# EAGLE design KAI EFUSE 2.0.0  (EAGLE 9.6.2)

## Sheet 1 of 8
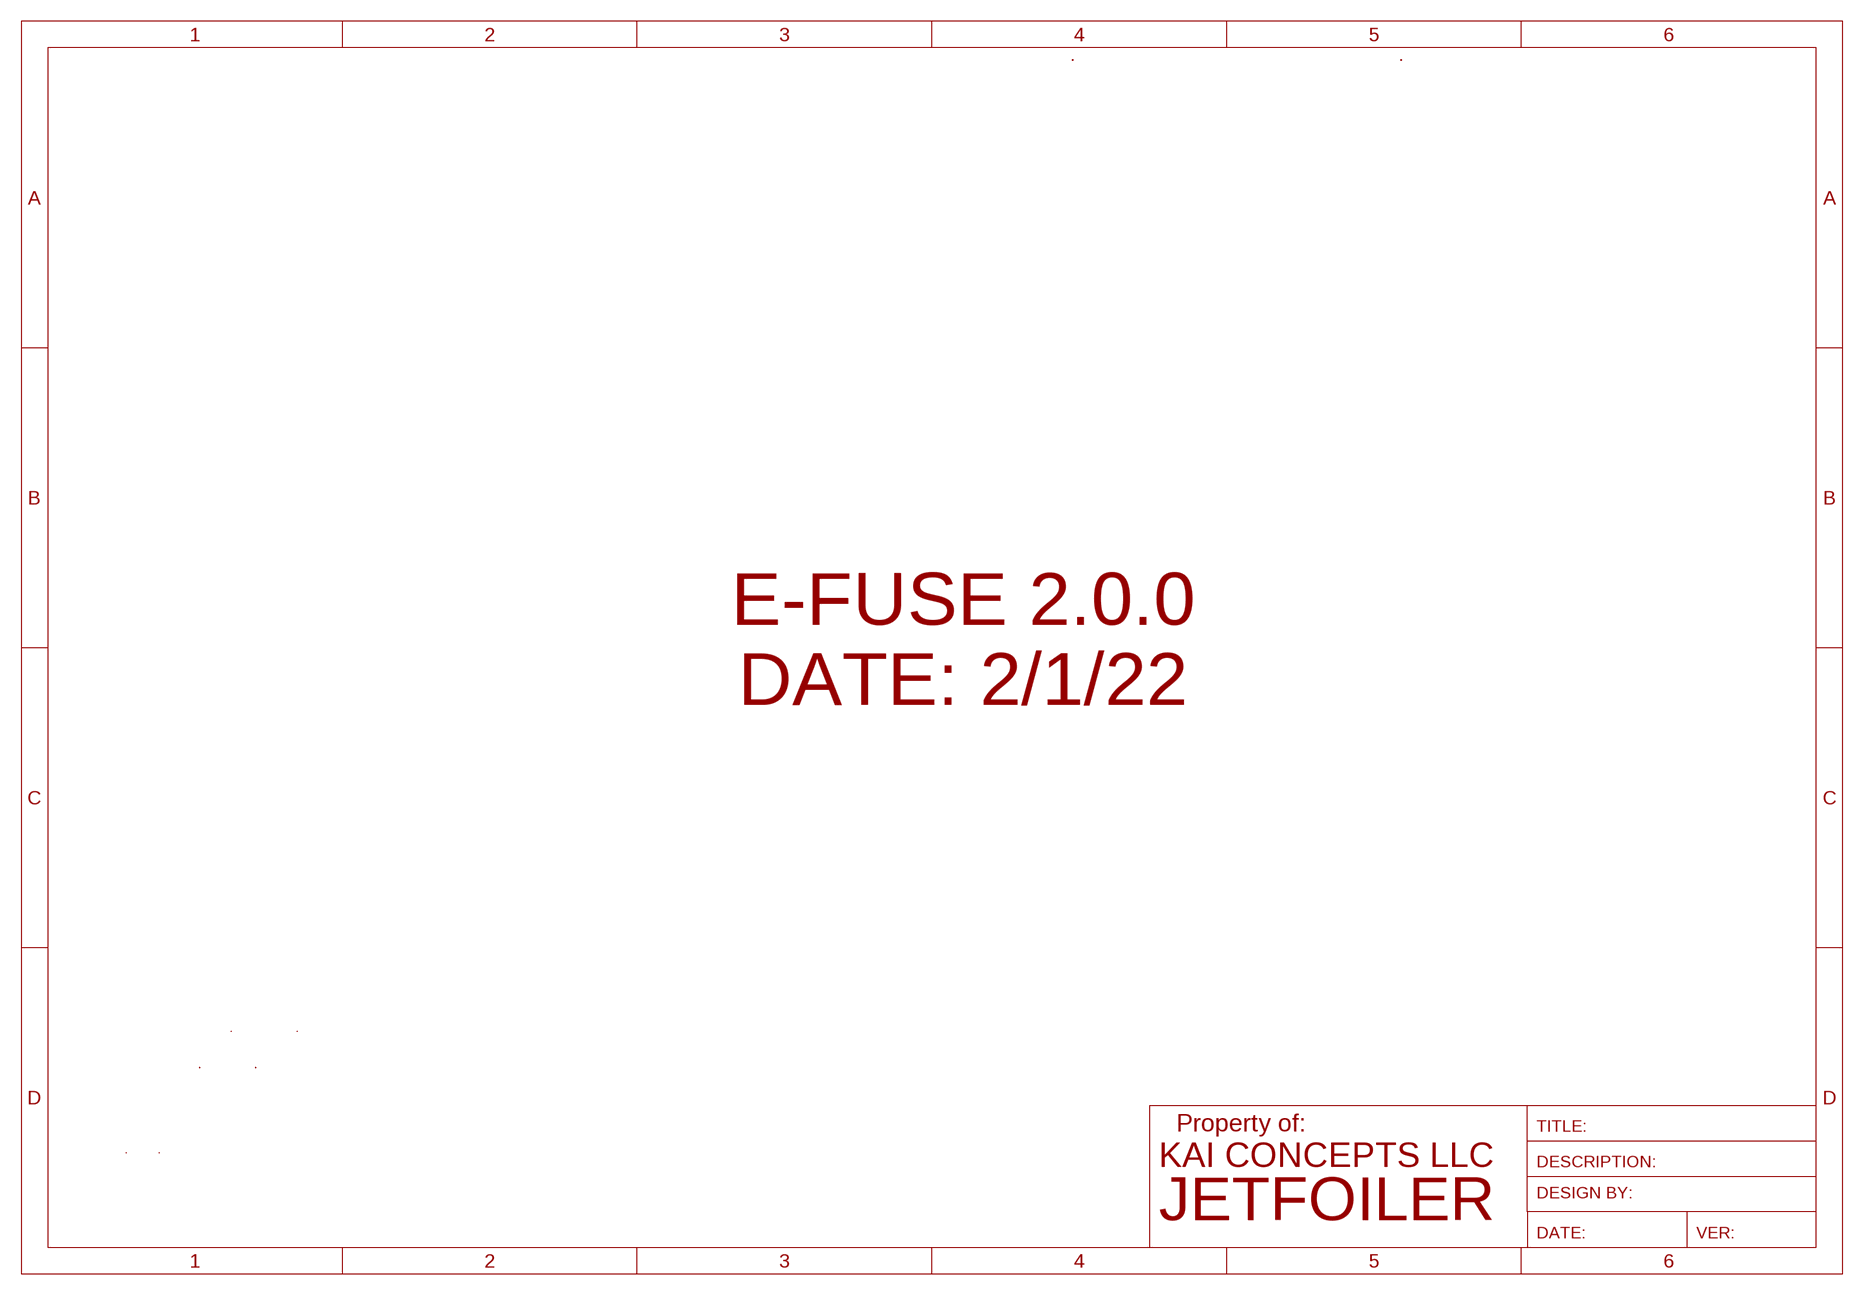
[diagram p0: schematic, sheet 1]

### Notes on the sheet
- E-FUSE 2.0.0
  DATE: 2/1/22

## Sheet 2 of 8: DC/DC
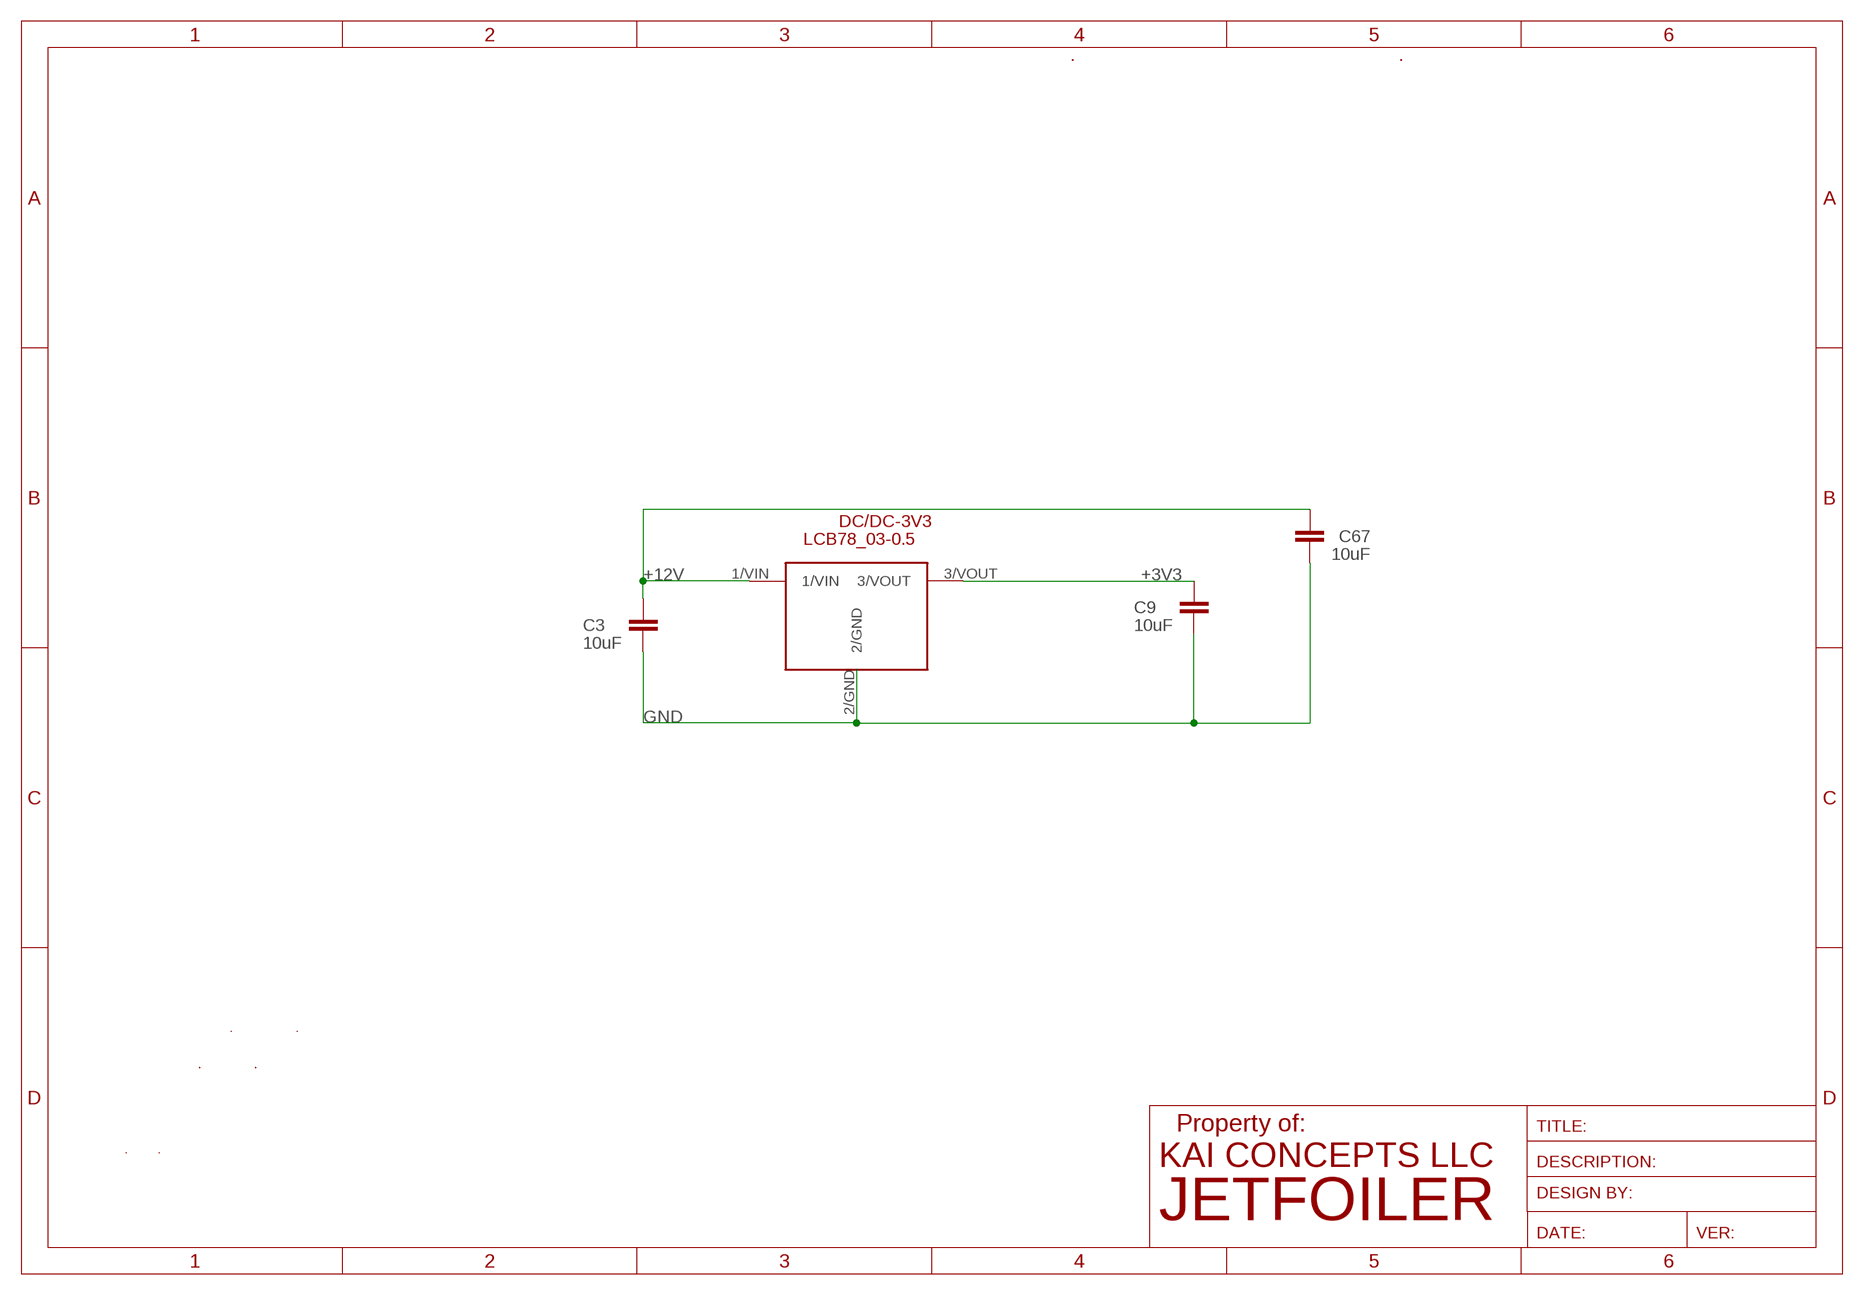
[diagram p1: schematic, sheet 2]

### Parts
C3  10uF  C-EUC1206  [C1206]
C9  10uF  C-EUC1206  [C1206]
C67  10uF  C-EUC1206  [C1206]
DC/DC-3V3  LCB78_03-0.5  3-SIP  [3-SIP]

### Nets
+3V3: C9.2 DC/DC-3V3.3/VOUT ; also sheet 3,6,7
+12V: C3.2 C67.2 DC/DC-3V3.1/VIN ; also sheet 4,5,6,7
GND: C3.1 C9.1 C67.1 DC/DC-3V3.2/GND ; also sheet 3,4,5,6,7

## Sheet 3 of 8: Over Current Protection
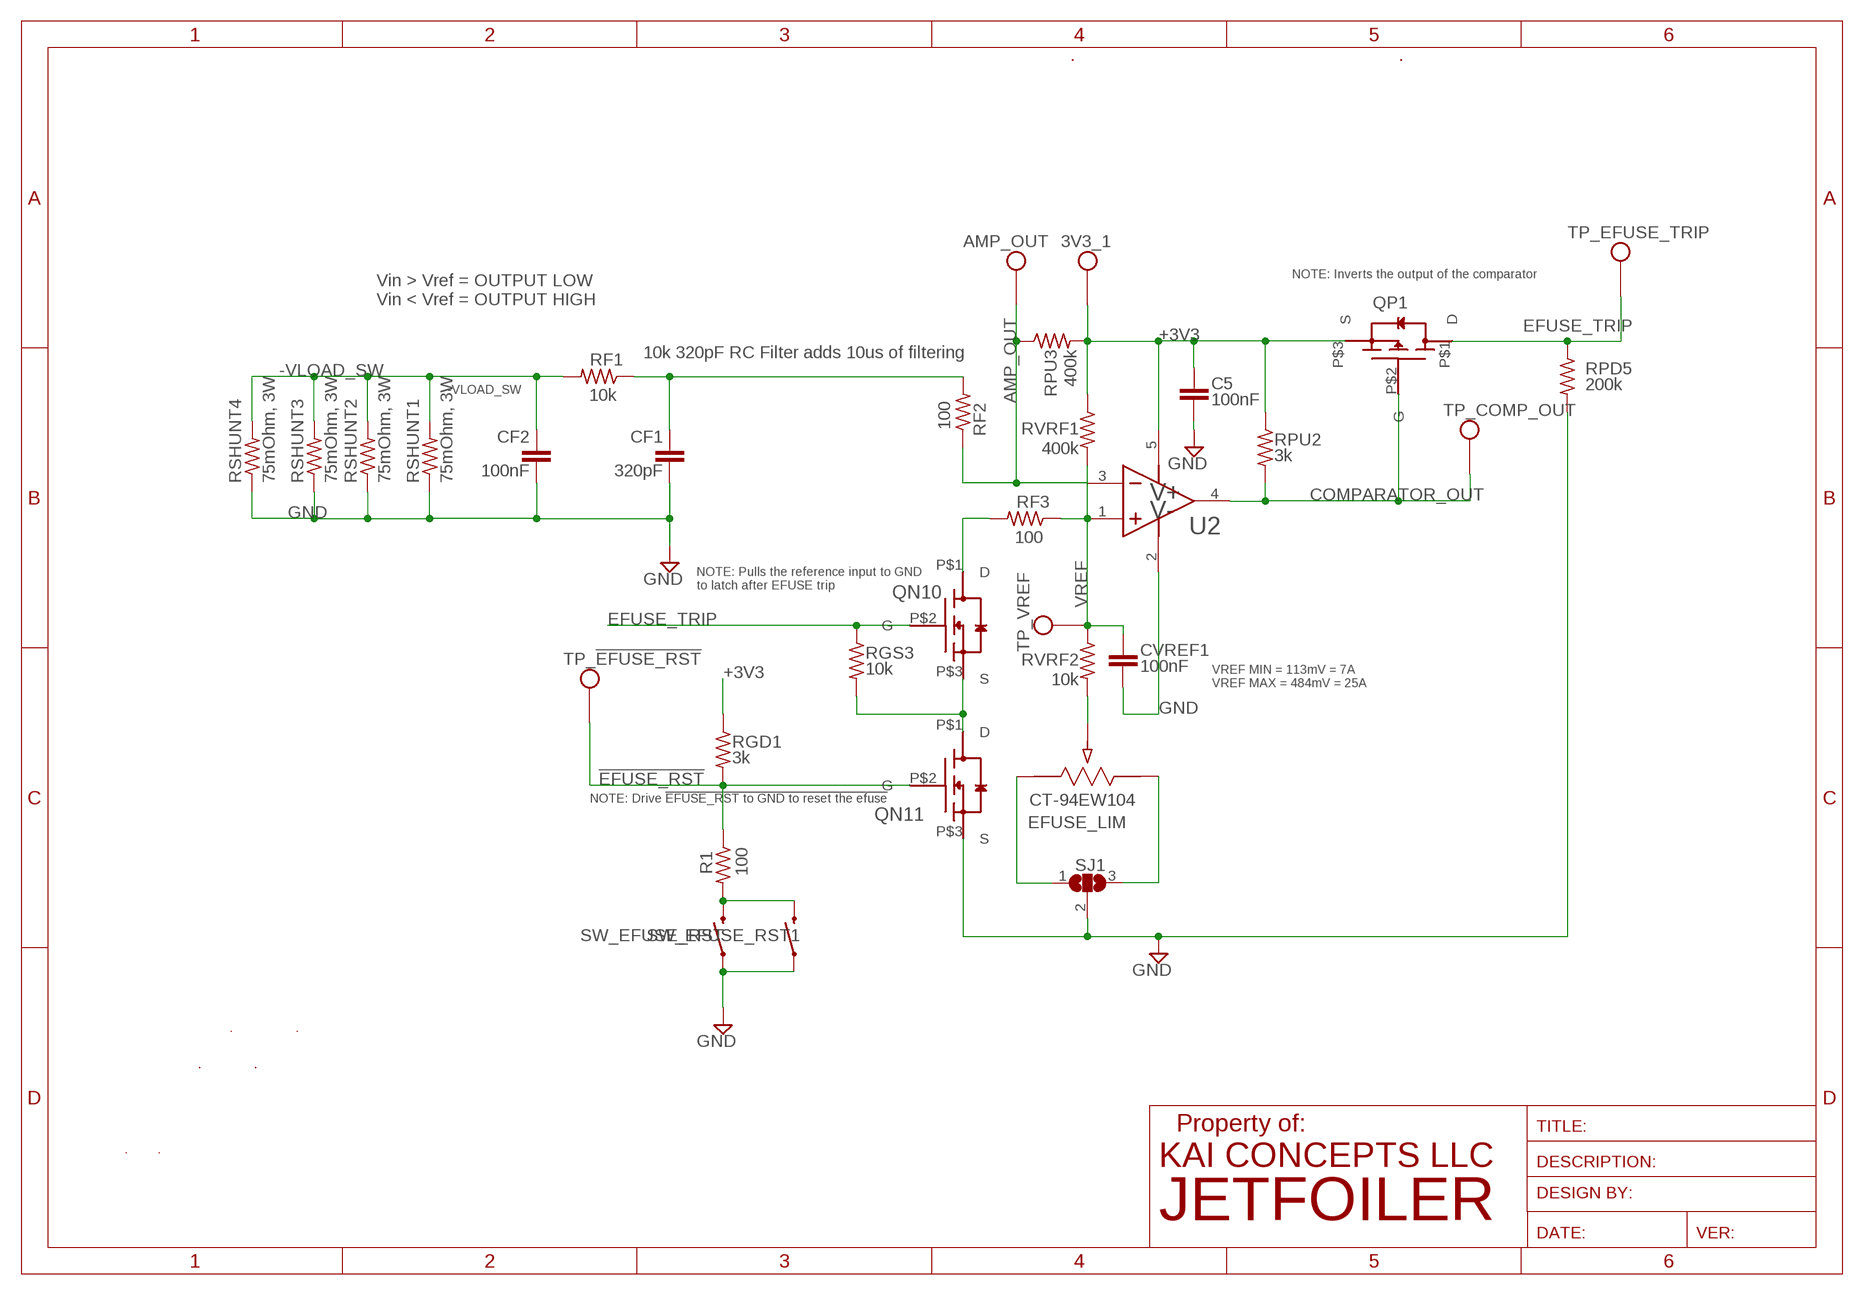
[diagram p2: schematic, sheet 3]

### Parts
3V3_1  THM_TESTPOINT_5000_SERIES  [THM-TESTPOINT]
AMP_OUT  THM_TESTPOINT_5000_SERIES  [THM-TESTPOINT]
C5  100nF  C-EUC0603  [C0603]
CF1  320pF  C-EUC0603  [C0603]
CF2  100nF  C-EUC0603  [C0603]
CVREF1  100nF  C-EUC0603  [C0603]
EFUSE_LIM  CT-94EW104  [POT_CT-94EW_NDC]
QN10  NFET-(SOT-23-3)(TO-236-3)(SC-59)  [SOT23,SC-59,TO-236-3]
QN11  NFET-(SOT-23-3)(TO-236-3)(SC-59)  [SOT23,SC-59,TO-236-3]
QP1  PFET-(SOT-23-3)(TO-236-3)(SC-59)  [SOT23,SC-59,TO-236-3]
R1  100  R-US_R0603  [R0603]
RF1  10k  R-US_R0603  [R0603]
RF2  100  R-US_R0603  [R0603]
RF3  100  R-US_R0603  [R0603]
RGD1  3k  R-US_R0603  [R0603]
RGS3  10k  R-US_R0603  [R0603]
RPD5  200k  R-US_R0603  [R0603]
RPU2  3k  R-US_R0603  [R0603]
RPU3  400k  R-US_R0603  [R0603]
RSHUNT1  75mOhm, 3W  R-US_R2512  [R2512]
RSHUNT2  75mOhm, 3W  R-US_R2512  [R2512]
RSHUNT3  75mOhm, 3W  R-US_R2512  [R2512]
RSHUNT4  75mOhm, 3W  R-US_R2512  [R2512]
RVRF1  400k  R-US_R0603  [R0603]
RVRF2  10k  R-US_R0603  [R0603]
SJ1  SJ2W  [SJ_2]
SW_EFUSE_RST  MOMENTARY-SWITCH-SPST-SMD-6.0X3.5MM  [TACTILE_SWITCH_SMD_6.0X3.5MM]
SW_EFUSE_RST1  MOMENTARY-SWITCH-SPST-SMD-6.0X3.5MM  [TACTILE_SWITCH_SMD_6.0X3.5MM]
TP_!EFUSE_RST  THM_TESTPOINT_5000_SERIES  [THM-TESTPOINT]
TP_COMP_OUT  THM_TESTPOINT_5000_SERIES  [THM-TESTPOINT]
TP_EFUSE_TRIP  THM_TESTPOINT_5000_SERIES  [THM-TESTPOINT]
TP_VREF  THM_TESTPOINT_5000_SERIES  [THM-TESTPOINT]
U2  LMV331M5X  [MF05A]

### Nets
!EFUSE_RST: QN11.P$2(G) R1.1 RGD1.2 TP_!EFUSE_RST.P1 ; also sheet 7
+3V3: 3V3_1.P1 C5.1 QP1.P$3(S) RGD1.1 RPU2.1 RPU3.2 RVRF1.1 U2.5(V+) ; also sheet 2,6,7
-VLOAD_SW: CF2.1 RF1.2 RSHUNT1.2 RSHUNT2.2 RSHUNT3.2 RSHUNT4.2 ; also sheet 4,7
AMP_OUT: AMP_OUT.P1 RF2.1 RPU3.1 U2.3(IN-)
COMPARATOR_OUT: QP1.P$2(G) RPU2.2 TP_COMP_OUT.P1 U2.4(OUT)
EFUSE_TRIP: QN10.P$2(G) QP1.P$1(D) RGS3.1 RPD5.1 TP_EFUSE_TRIP.P1 ; also sheet 4,5,6,7
GND: C5.2 CF1.2 CF2.2 CVREF1.2 QN11.P$3(S) RPD5.2 RSHUNT1.1 RSHUNT2.1 RSHUNT3.1 RSHUNT4.1 SJ1.2 SW_EFUSE_RST1.1 SW_EFUSE_RST.1 U2.2(V-) ; also sheet 2,4,5,6,7
N$9: QN10.P$1(D) RF3.2
N$13: QN10.P$3(S) QN11.P$1(D) RGS3.2
N$14: R1.2 SW_EFUSE_RST1.2 SW_EFUSE_RST.2
N$15: EFUSE_LIM.2 RVRF2.2
N$19: EFUSE_LIM.1 SJ1.1
N$20: EFUSE_LIM.3 SJ1.3
VOUTB: CF1.1 RF1.1 RF2.2
VREF: CVREF1.1 RF3.1 RVRF1.2 RVRF2.1 TP_VREF.P1 U2.1(IN+) ; also sheet 7

### Notes on the sheet
- NOTE: Inverts the output of the comparator
- Vin > Vref = OUTPUT LOW 
  Vin < Vref = OUTPUT HIGH
- 10k 320pF RC Filter adds 10us of filtering
- NOTE: Pulls the reference input to GND 
  to latch after EFUSE trip
- VREF MIN = 113mV = 7A
  VREF MAX = 484mV = 25A
- NOTE: Drive !EFUSE_RST to GND to reset the efuse

## Sheet 4 of 8: LOW SIDE SSR
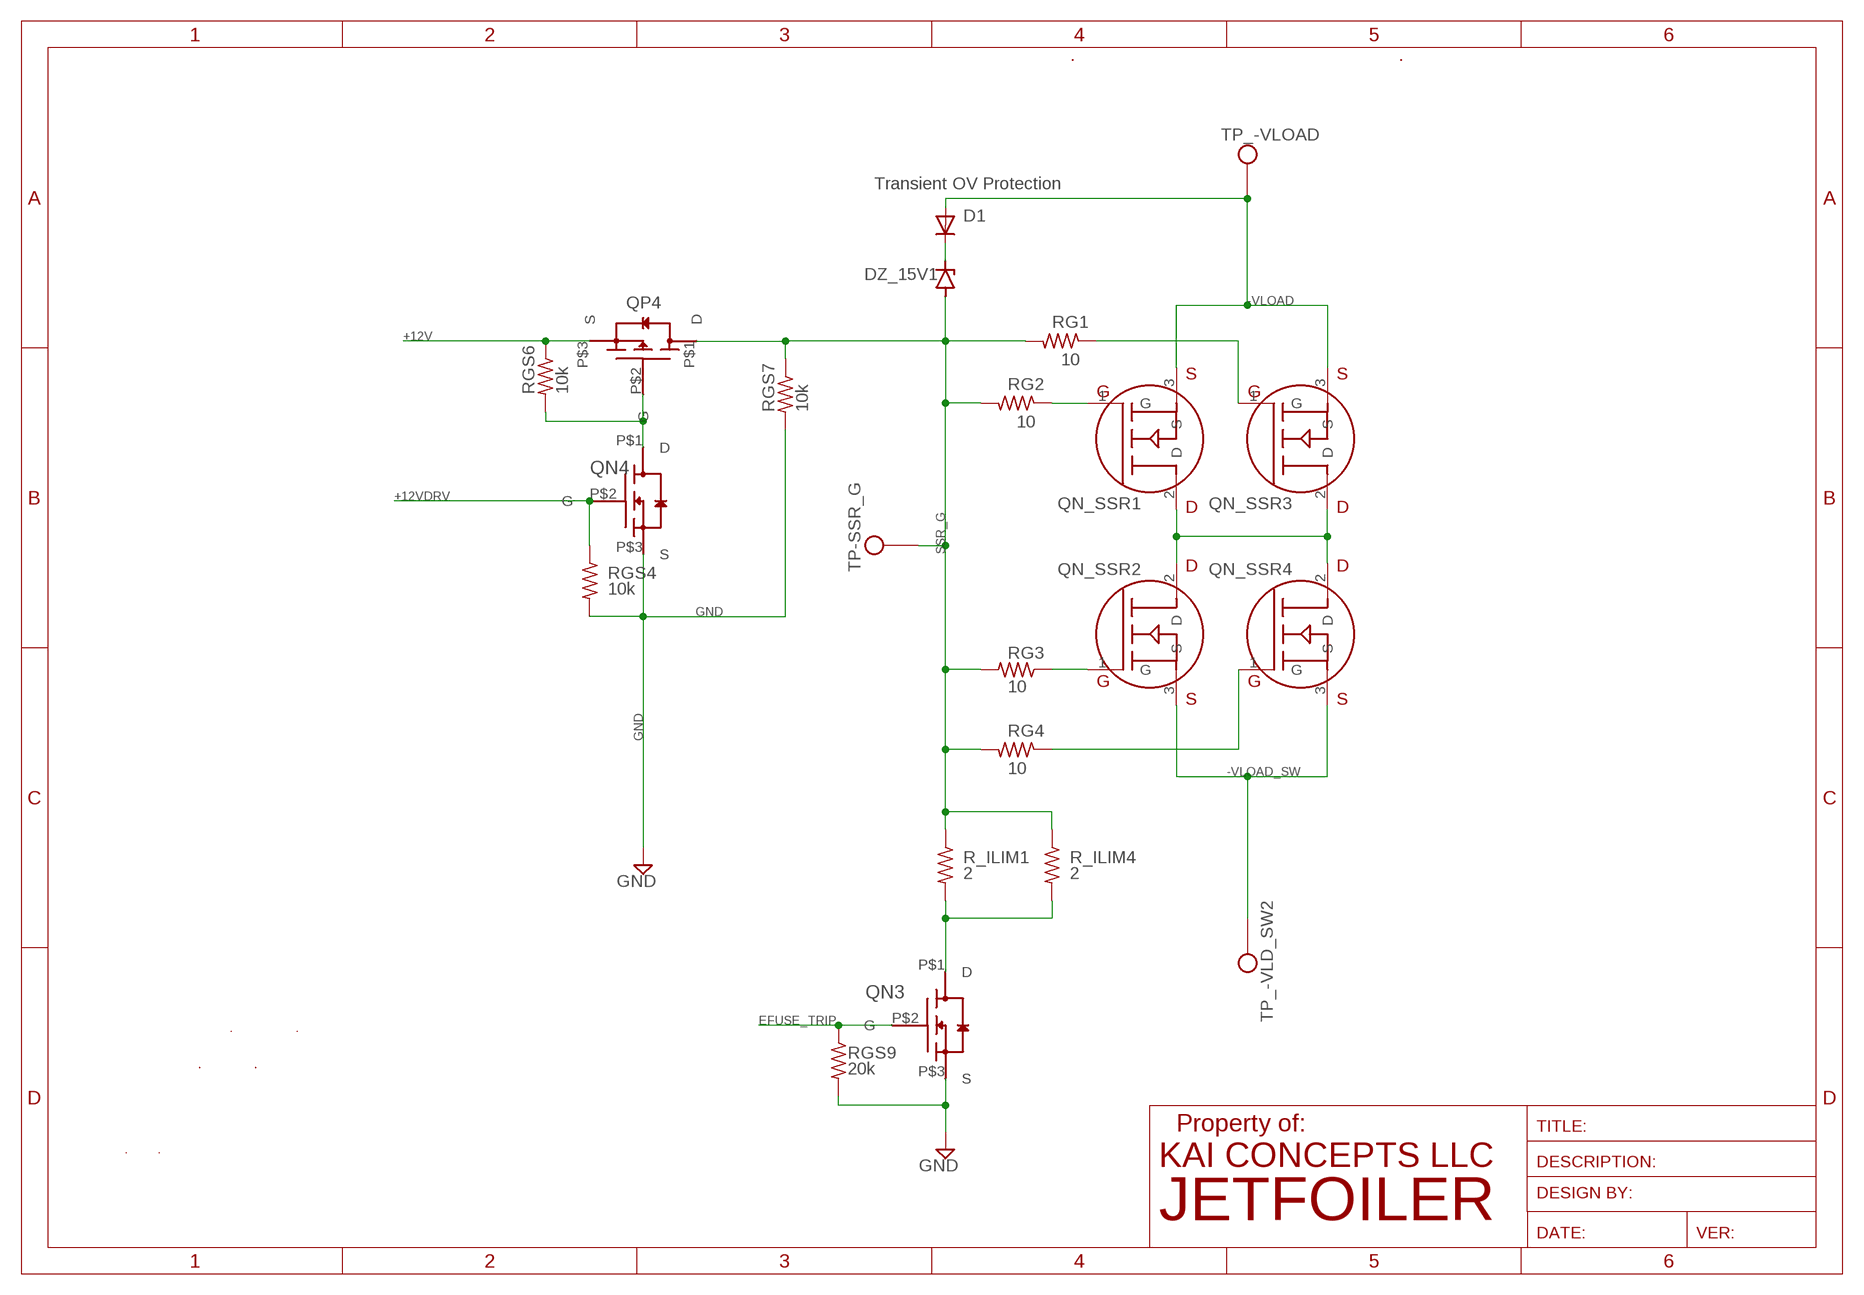
[diagram p3: schematic, sheet 4]

### Parts
D1  DIODESMA  [SMADIODE]
DZ_15V1  NZH15B,115  ZENER_MMSZ5240BTDO-219-AB(SOD123F)  [SODFL3718X115]
QN3  NFET-(SOT-23-3)(TO-236-3)(SC-59)  [SOT23,SC-59,TO-236-3]
QN4  NFET-(SOT-23-3)(TO-236-3)(SC-59)  [SOT23,SC-59,TO-236-3]
QN_SSR1  IPB60R060P7ATMA1  [D2PACK]
QN_SSR2  IPB60R060P7ATMA1  [D2PACK]
QN_SSR3  IPB60R060P7ATMA1  [D2PACK]
QN_SSR4  IPB60R060P7ATMA1  [D2PACK]
QP4  PFET-(SOT-23-3)(TO-236-3)(SC-59)  [SOT23,SC-59,TO-236-3]
R_ILIM1  2  R-US_R1206  [R1206]
R_ILIM4  2  R-US_R1206  [R1206]
RG1  10  R-US_R1206  [R1206]
RG2  10  R-US_R1206  [R1206]
RG3  10  R-US_R1206  [R1206]
RG4  10  R-US_R1206  [R1206]
RGS4  10k  R-US_R0603  [R0603]
RGS6  10k  R-US_R0603  [R0603]
RGS7  10k  R-US_R0603  [R0603]
RGS9  20k  R-US_R0603  [R0603]
TP-SSR_G  THM_TESTPOINT_5000_SERIES  [THM-TESTPOINT]
TP_-VLD_SW2  THM_TESTPOINT_5000_SERIES  [THM-TESTPOINT]
TP_-VLOAD  THM_TESTPOINT_5000_SERIES  [THM-TESTPOINT]

### Nets
+12V: QP4.P$3(S) RGS6.1 ; also sheet 2,5,6,7
+12VDRV: QN4.P$2(G) RGS4.1 ; also sheet 5,7
-VLOAD: D1.A QN_SSR1.3(S) QN_SSR3.3(S) TP_-VLOAD.P1 ; also sheet 7
-VLOAD_SW: QN_SSR2.3(S) QN_SSR4.3(S) TP_-VLD_SW2.P1 ; also sheet 3,7
EFUSE_TRIP: QN3.P$2(G) RGS9.1 ; also sheet 3,5,6,7
GND: QN3.P$3(S) QN4.P$3(S) RGS4.2 RGS7.2 RGS9.2 ; also sheet 2,3,5,6,7
N$3: QN4.P$1(D) QP4.P$2(G) RGS6.2
N$5: D1.C DZ_15V1.1(C)
N$7: QN_SSR2.1(G) RG3.1
N$8: QN_SSR3.1(G) RG1.1
N$10: QN_SSR4.1(G) RG4.1
N$12: QN_SSR1.1(G) RG2.1
N$17: QN3.P$1(D) R_ILIM1.2 R_ILIM4.2
SSR_G: DZ_15V1.2(A) QP4.P$1(D) R_ILIM1.1 R_ILIM4.1 RG1.2 RG2.2 RG3.2 RG4.2 RGS7.1 TP-SSR_G.P1
VSS_A1: QN_SSR1.2(D) QN_SSR2.2(D) QN_SSR3.2(D) QN_SSR4.2(D)

### Notes on the sheet
- Transient OV Protection

## Sheet 5 of 8: DRIVER LOAD SWITCH
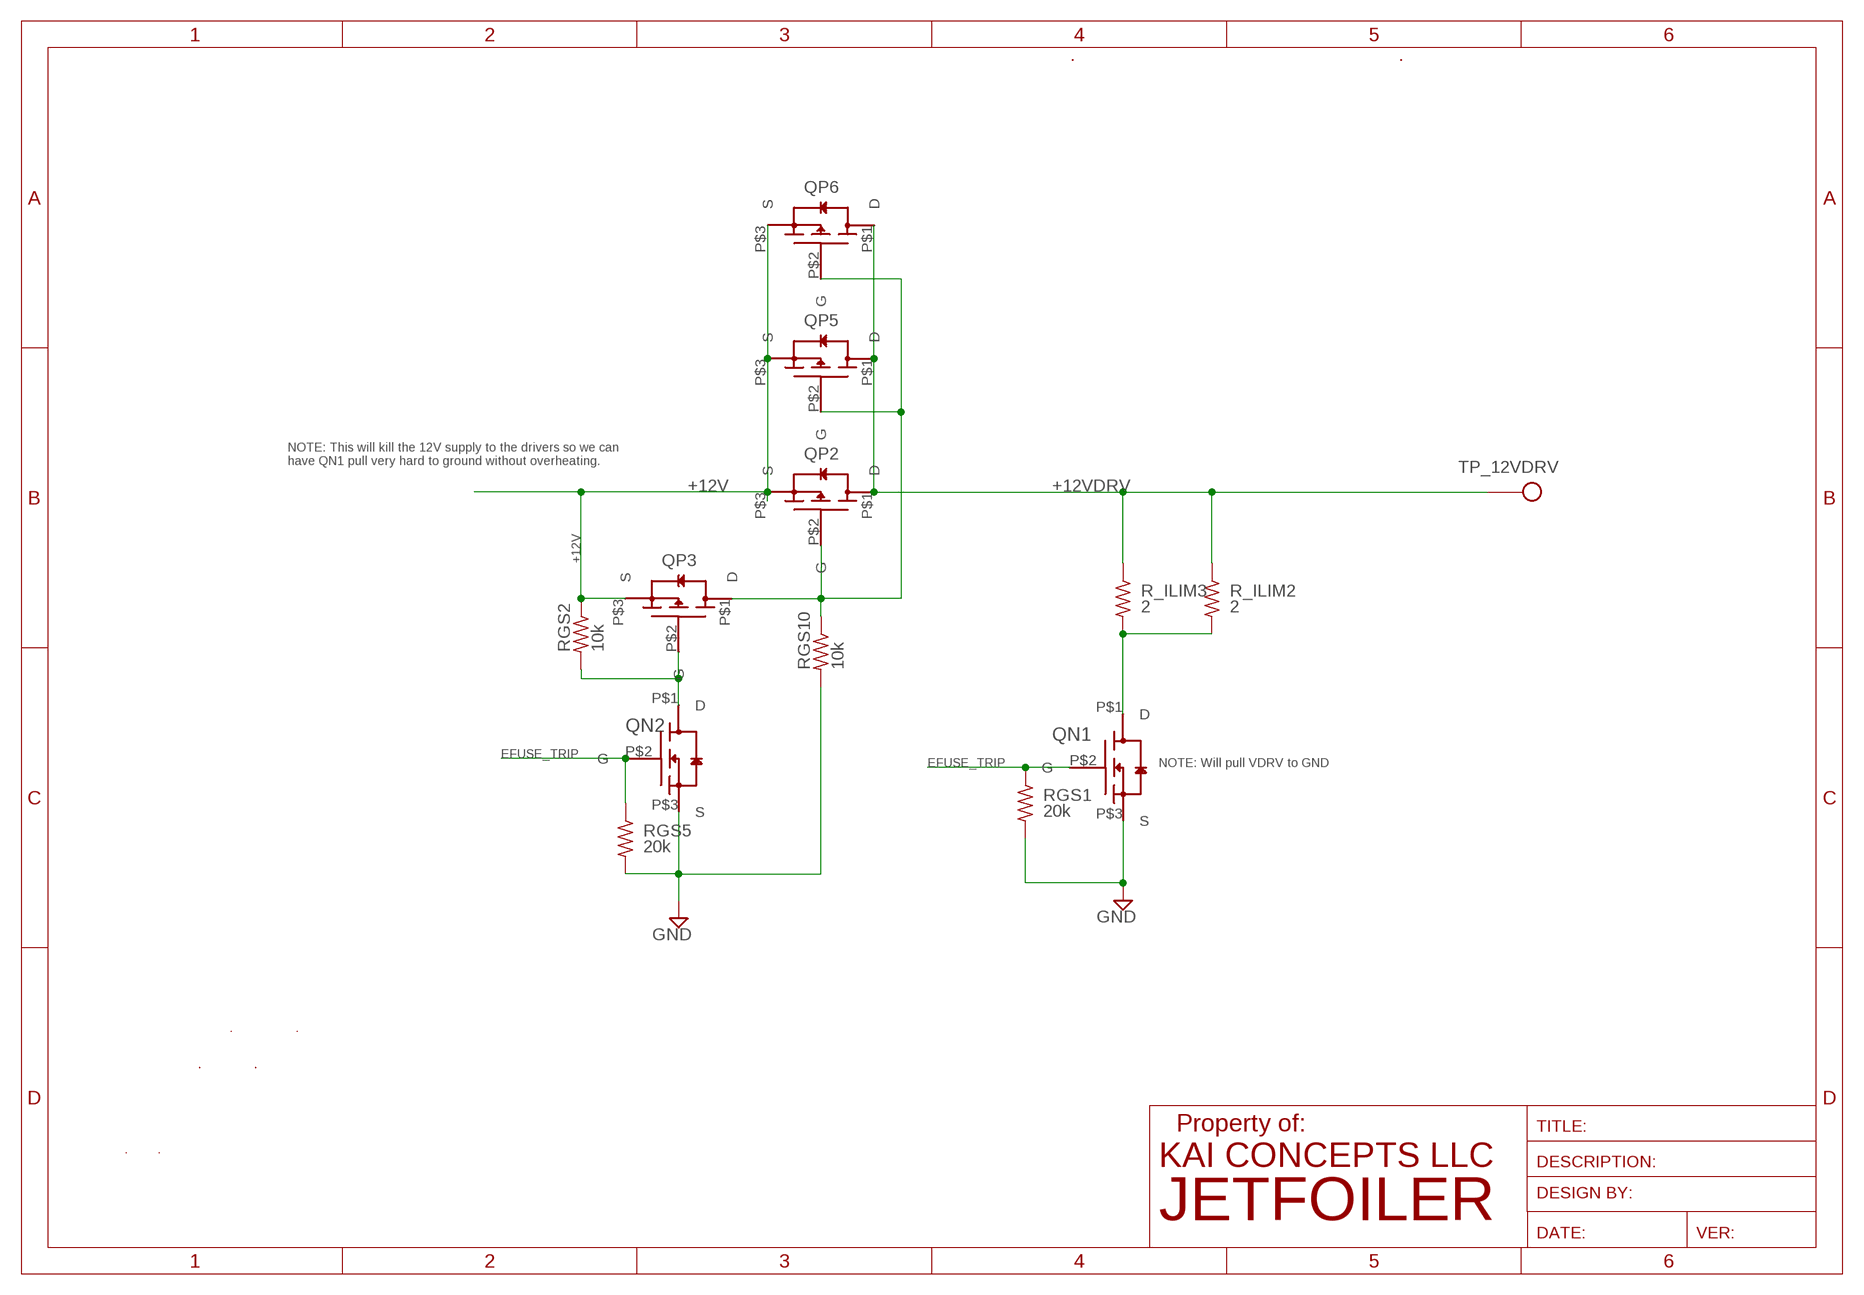
[diagram p4: schematic, sheet 5]

### Parts
QN1  NFET-(SOT-23-3)(TO-236-3)(SC-59)  [SOT23,SC-59,TO-236-3]
QN2  NFET-(SOT-23-3)(TO-236-3)(SC-59)  [SOT23,SC-59,TO-236-3]
QP2  PFET-(SOT-23-3)(TO-236-3)(SC-59)  [SOT23,SC-59,TO-236-3]
QP3  PFET-(SOT-23-3)(TO-236-3)(SC-59)  [SOT23,SC-59,TO-236-3]
QP5  PFET-(SOT-23-3)(TO-236-3)(SC-59)  [SOT23,SC-59,TO-236-3]
QP6  PFET-(SOT-23-3)(TO-236-3)(SC-59)  [SOT23,SC-59,TO-236-3]
R_ILIM2  2  R-US_R1206  [R1206]
R_ILIM3  2  R-US_R1206  [R1206]
RGS1  20k  R-US_R0603  [R0603]
RGS2  10k  R-US_R0603  [R0603]
RGS5  20k  R-US_R0603  [R0603]
RGS10  10k  R-US_R0603  [R0603]
TP_12VDRV  THM_TESTPOINT_5000_SERIES  [THM-TESTPOINT]

### Nets
+12V: QP2.P$3(S) QP3.P$3(S) QP5.P$3(S) QP6.P$3(S) RGS2.1 ; also sheet 2,4,6,7
+12VDRV: QP2.P$1(D) QP5.P$1(D) QP6.P$1(D) R_ILIM2.1 R_ILIM3.1 TP_12VDRV.P1 ; also sheet 4,7
EFUSE_TRIP: QN1.P$2(G) QN2.P$2(G) RGS1.1 RGS5.1 ; also sheet 3,4,6,7
GND: QN1.P$3(S) QN2.P$3(S) RGS1.2 RGS5.2 RGS10.2 ; also sheet 2,3,4,6,7
N$16: QP2.P$2(G) QP3.P$1(D) QP5.P$2(G) QP6.P$2(G) RGS10.1
N$18: QN2.P$1(D) QP3.P$2(G) RGS2.2
OUTA_H: QN1.P$1(D) R_ILIM2.2 R_ILIM3.2

### Notes on the sheet
- NOTE: This will kill the 12V supply to the drivers so we can 
  have QN1 pull very hard to ground without overheating.
- NOTE: Will pull VDRV to GND

## Sheet 6 of 8: LED INDICATORS & TEST POINTS
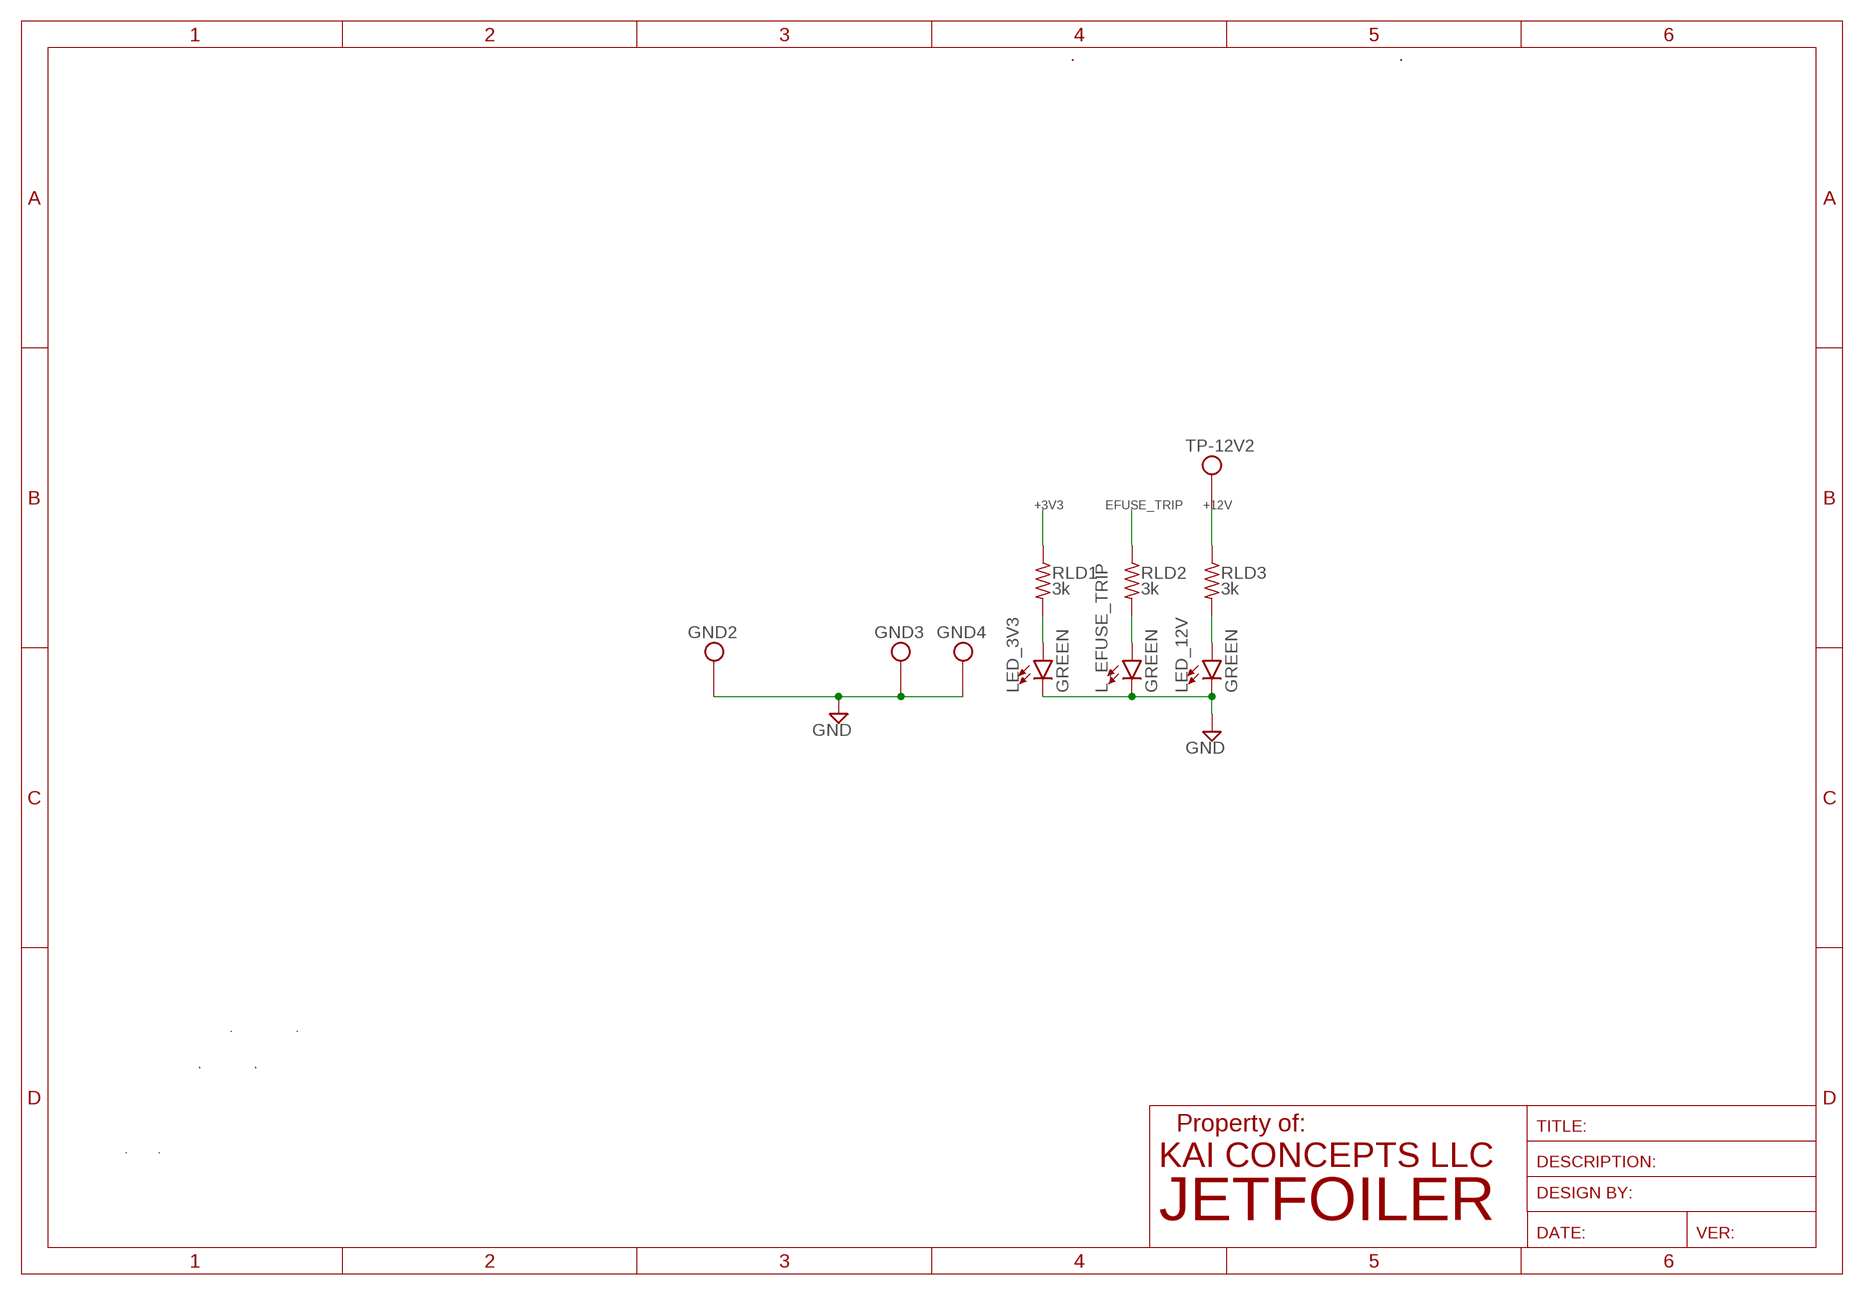
[diagram p5: schematic, sheet 6]

### Parts
GND2  THM_TESTPOINT_5000_SERIES  [THM-TESTPOINT]
GND3  THM_TESTPOINT_5000_SERIES  [THM-TESTPOINT]
GND4  THM_TESTPOINT_5000_SERIES  [THM-TESTPOINT]
L_EFUSE_TRIP  GREEN  LED-GREEN1206  [LED-1206]
LED_3V3  GREEN  LED-GREEN1206  [LED-1206]
LED_12V  GREEN  LED-GREEN1206  [LED-1206]
RLD1  3k  R-US_R0603  [R0603]
RLD2  3k  R-US_R0603  [R0603]
RLD3  3k  R-US_R0603  [R0603]
TP-12V2  THM_TESTPOINT_5000_SERIES  [THM-TESTPOINT]

### Nets
+3V3: RLD1.1 ; also sheet 2,3,7
+12V: RLD3.1 TP-12V2.P1 ; also sheet 2,4,5,7
EFUSE_TRIP: RLD2.1 ; also sheet 3,4,5,7
GND: GND2.P1 GND3.P1 GND4.P1 L_EFUSE_TRIP.C LED_3V3.C LED_12V.C ; also sheet 2,3,4,5,7
N$1: LED_3V3.A RLD1.2
N$2: L_EFUSE_TRIP.A RLD2.2
N$4: LED_12V.A RLD3.2

## Sheet 7 of 8: BOARD TO BOARD CONNECTORS
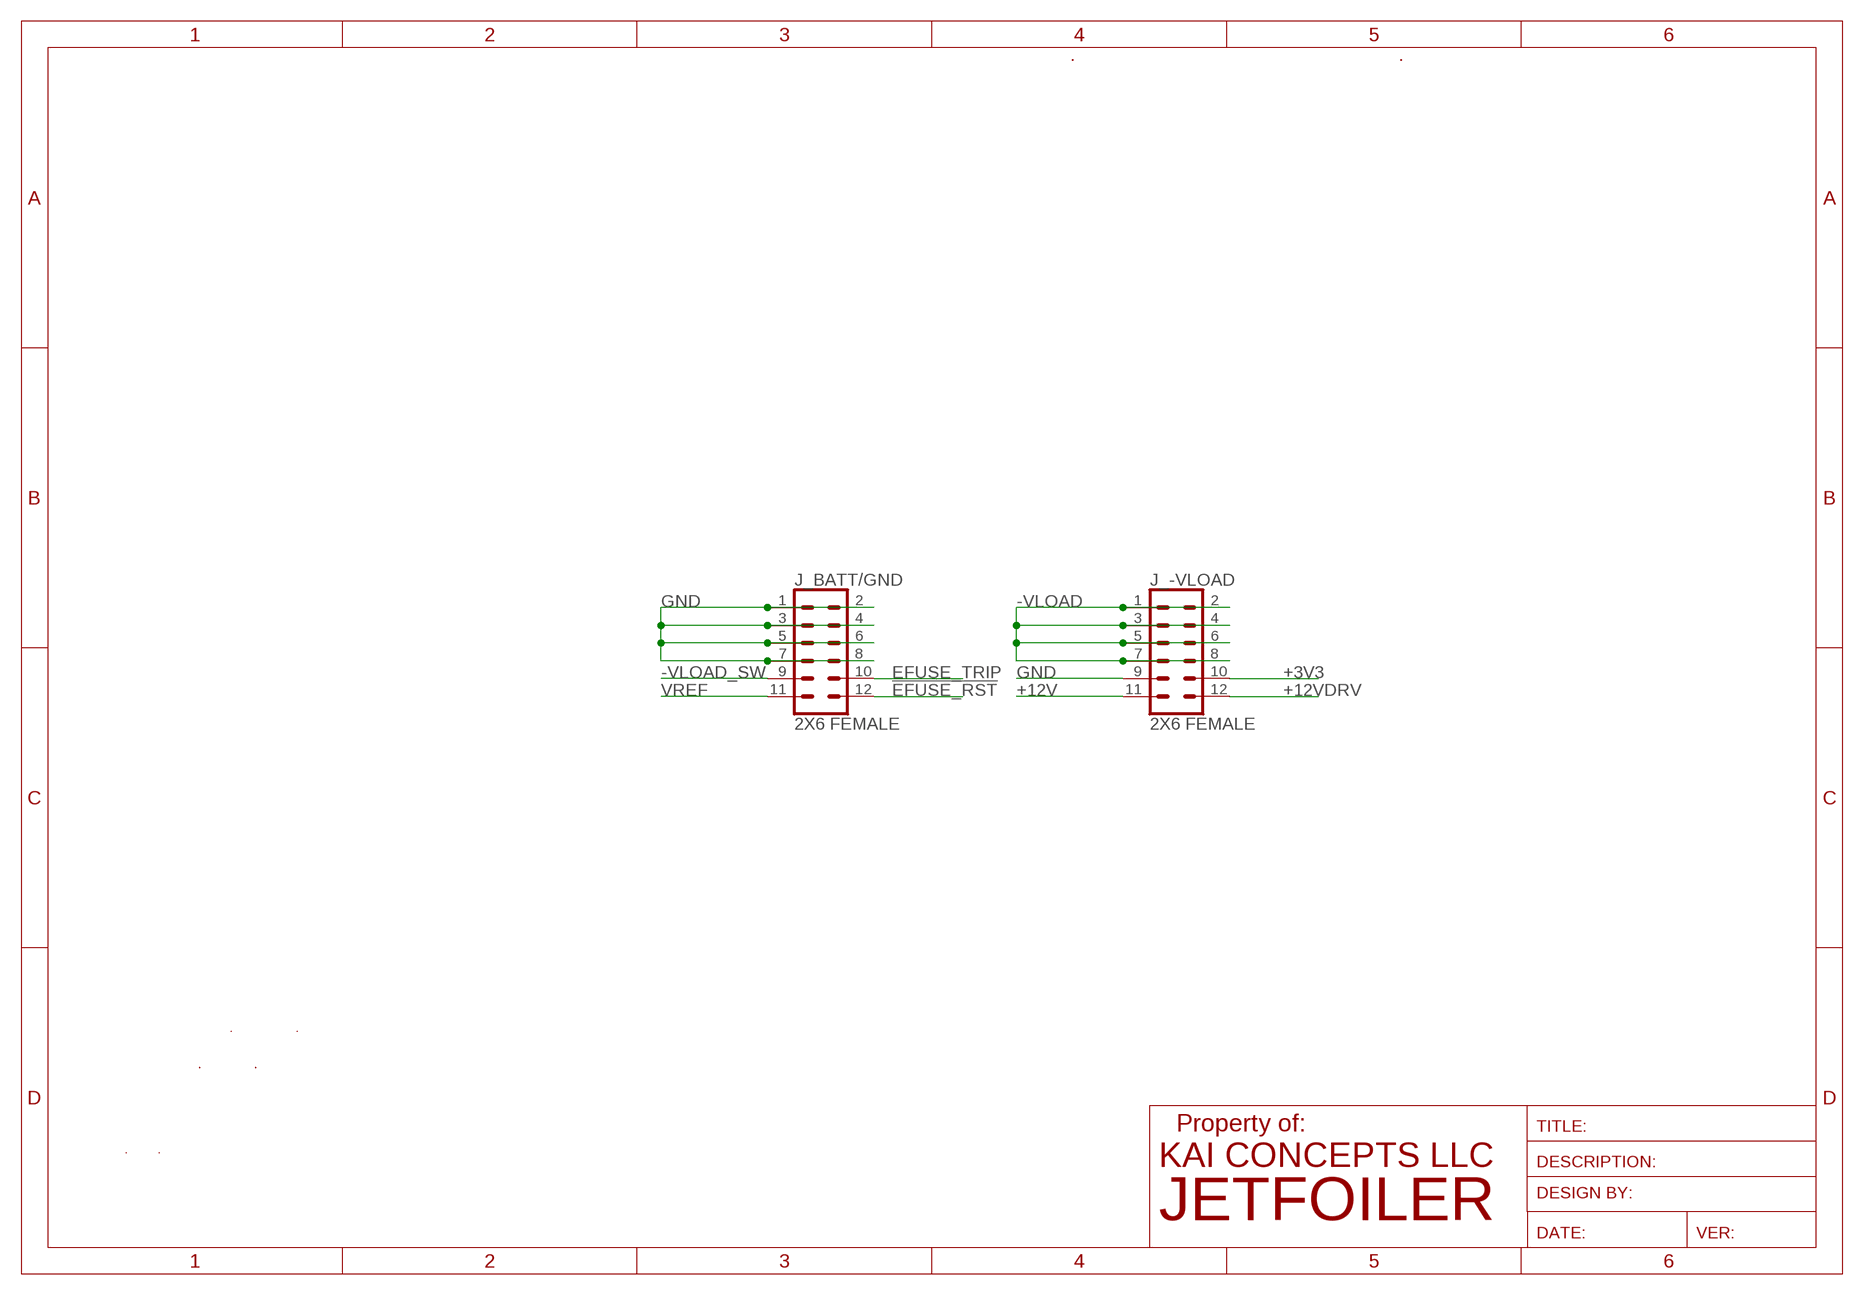
[diagram p6: schematic, sheet 7]

### Parts
J_-VLOAD  2X6 FEMALE  CONN_06X2PTH_FEMALE  [2X6]
J_BATT/GND  2X6 FEMALE  CONN_06X2PTH_FEMALE  [2X6]

### Nets
!EFUSE_RST: J_BATT/GND.12 ; also sheet 3
+3V3: J_-VLOAD.10 ; also sheet 2,3,6
+12V: J_-VLOAD.11 ; also sheet 2,4,5,6
+12VDRV: J_-VLOAD.12 ; also sheet 4,5
-VLOAD: J_-VLOAD.1 J_-VLOAD.2 J_-VLOAD.3 J_-VLOAD.4 J_-VLOAD.5 J_-VLOAD.6 J_-VLOAD.7 J_-VLOAD.8 ; also sheet 4
-VLOAD_SW: J_BATT/GND.9 ; also sheet 3,4
EFUSE_TRIP: J_BATT/GND.10 ; also sheet 3,4,5,6
GND: J_-VLOAD.9 J_BATT/GND.1 J_BATT/GND.2 J_BATT/GND.3 J_BATT/GND.4 J_BATT/GND.5 J_BATT/GND.6 J_BATT/GND.7 J_BATT/GND.8 ; also sheet 2,3,4,5,6
VREF: J_BATT/GND.11 ; also sheet 3

## Sheet 8 of 8: MECHANICAL
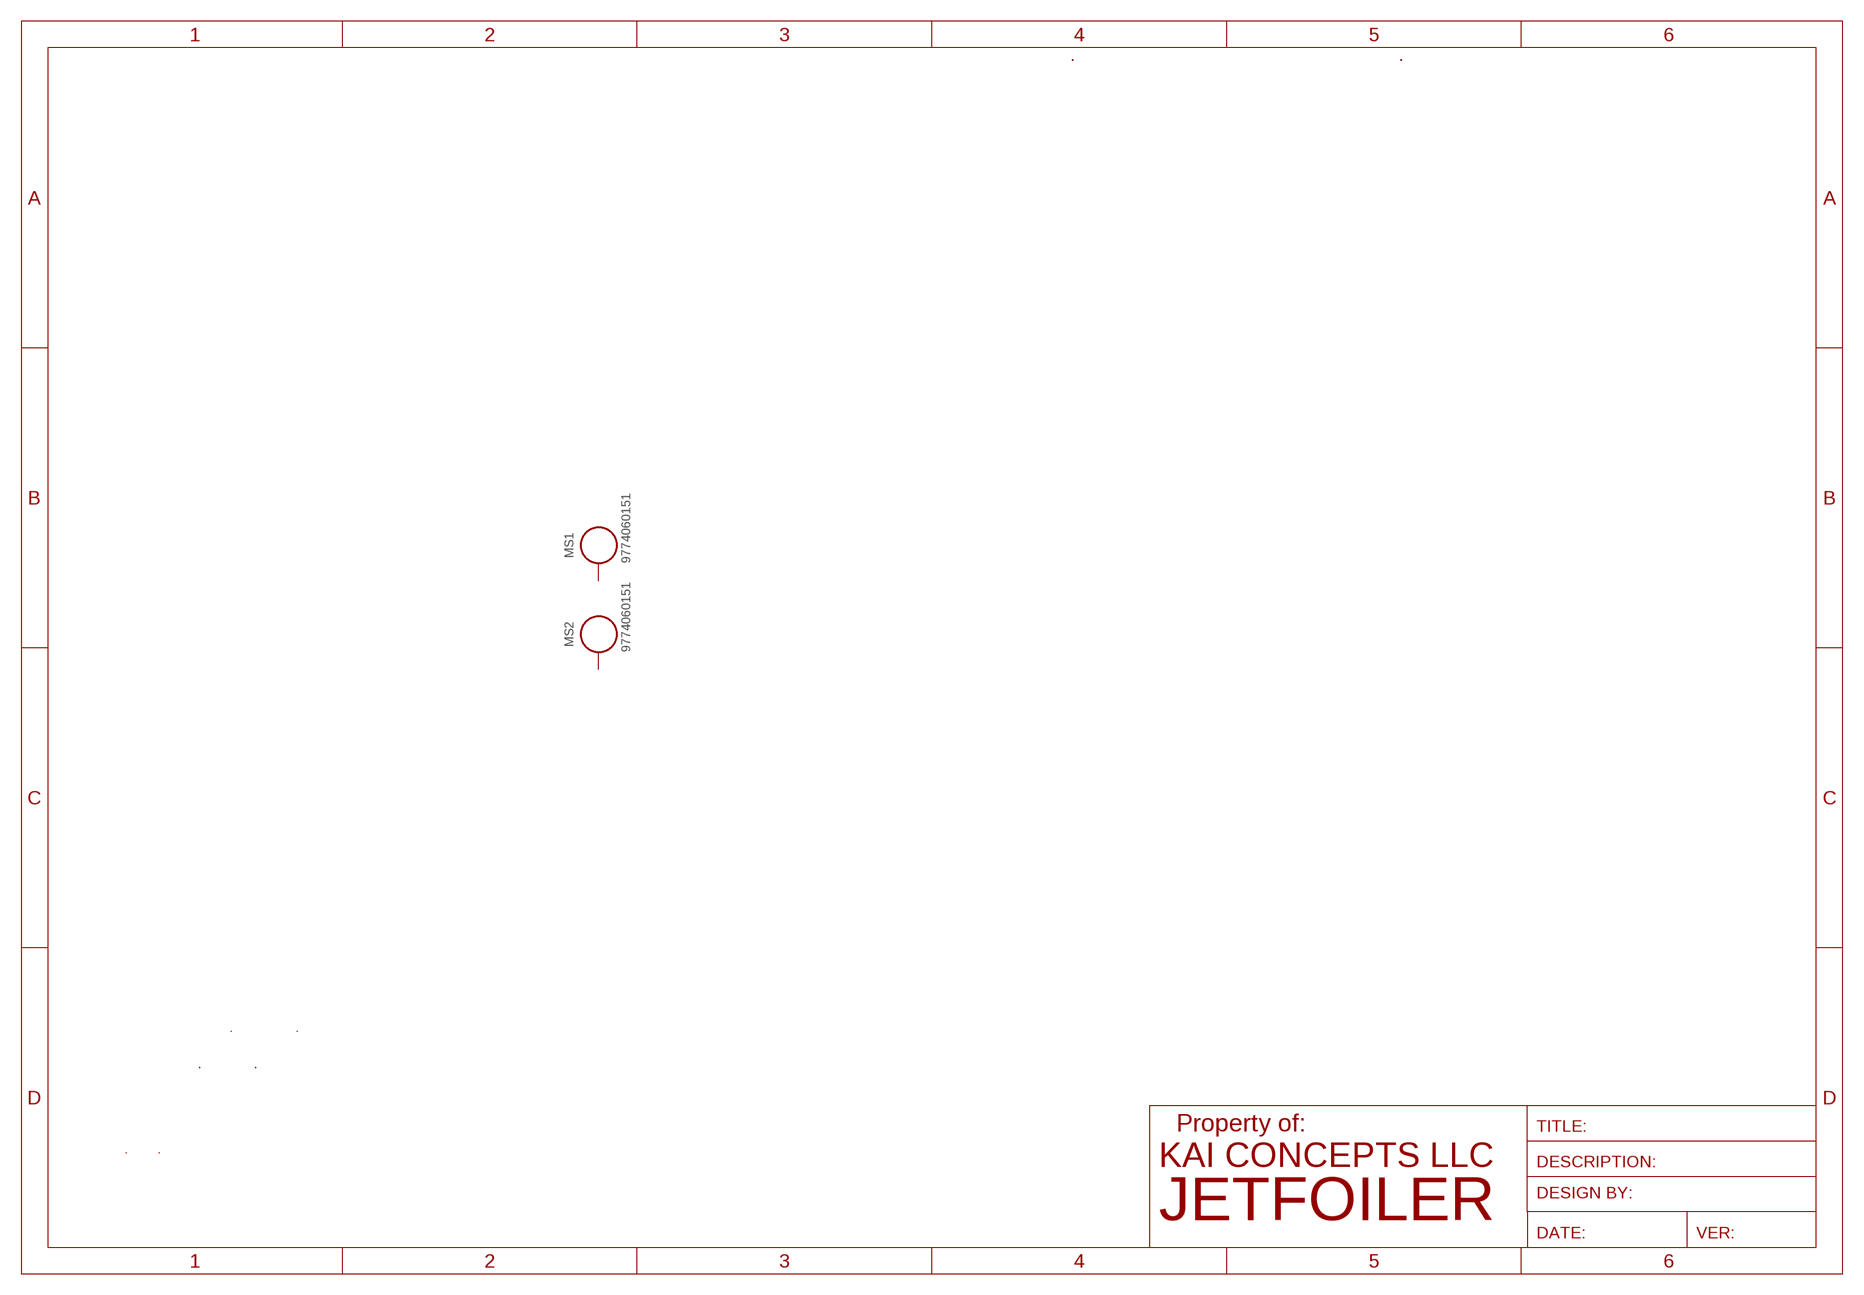
[diagram p7: schematic, sheet 8]

### Parts
MS1  9774060151  WA-SMSI_9774XXX151_9774060151  [WA-SMSI_9774060151]
MS2  9774060151  WA-SMSI_9774XXX151_9774060151  [WA-SMSI_9774060151]
Unconnected: MS1.1 MS2.1

## Library data of the parts
3V3_1 AMP_OUT GND2-GND4 TP-12V2 TP-SSR_G TP_12VDRV TP_!EFUSE_RST TP_-VLD_SW2 TP_-VLOAD TP_COMP_OUT TP_EFUSE_TRIP TP_VREF = PSFBC:THM_TESTPOINT_5000_SERIES
C3 C9 C67 = rcl:C-EU: CAPACITOR, European symbol; LCSC_PART: C13585; SPICEPREFIX: C
C5 CF1 CF2 CVREF1 = rcl:C-EU: CAPACITOR, European symbol; LCSC_PART: C14663; SPICEPREFIX: C
D1 = adafruit:DIODE: Diode SMADIODE - SMA Surface Mount Package 20V 1A Schottky Diode Digikey: 641-1014-6-ND DO-1N4148 - Through Hole Small Current Diode SOD-123 20V 1 A (.5mV Vf) Schottky Diode - Digikey: MBRX120TPMSCT-ND SOD-323 10V 570mA (.38mV Vf, 3ns) Schottky Diode - Digikey: ZLLS410CT-ND SOD-523 30V 30mA Schottky Diode (RB751S-40TE61) - Digikey: RB751S-40TE61CT-ND SOT23-R/W - SOT23 Package (R = Solder Paste/Reflow Ovens, W = Hand-Soldering) BAT54Film 40V 300mA - Digikey: 497-7162-1-ND; LCSC_PART: C110531
DC/DC-3V3 = KVRLABS-DCDC:3-SIP; LCSC_PART: DNP; MODEL: R-783.3-1.0
DZ_15V1 = Diode:ZENER_: Zener Diode - Popular parts; CATEGORY: Diode; DESCRIPTION: DIODE ZENER 10V 500MW SOD123; LCSC_PART: C173428; MANUFACTURER: ON Semiconductor; MPN: MMSZ5240BT1G; SUB-CATEGORY: Zener; THERMALLOSS: 0.5W; VALUE: MMSZ5240BT1G
EFUSE_LIM = KVRLABS-Potentiometers:CT-94EW104; COPYRIGHT: Copyright (C) 2021 Ultra Librarian. All rights reserved.; DIGI-KEY_PART_NUMBER_1: CT94EW104-ND; LCSC_PART: DNP; MANUFACTURER_PART_NUMBER: CT-94EW104; MFR_NAME: Nidec Copal Electronics
J_-VLOAD J_BATT/GND = SparkFun-Connectors:CONN_06X2: Multi connection point. Often used as Generic Header-pin footprint for 0.1 inch spaced/style header connections On any of the 0.1 inch spaced packages, you can populate with these: Break Away Headers - Straight <https://www.sparkfun.com/products/116> (PRT-00116) Break Away Male Headers - Right Angle <https://www.sparkfun.com/products/553> (PRT-00553) Female Headers <https://www.sparkfun.com/products/115> (PRT-00115) Break Away Headers - Machine Pin <https://www.sparkfun.com/products/117> (PRT-00117) Break Away Female Headers - Swiss Machine Pin <https://www.sparkfun.com/products/743> (PRT-00743); LCSC_PART: DNP; MODEL: TSW-106-05-G-D; PROD_ID: CONN-12423
L_EFUSE_TRIP LED_3V3 LED_12V = SparkFun-LED:LED-GREEN: Green SMD LED Used in manufacturing of various products at SparkFun Packages: 0603 - SMD 0603 package [Product Link] <http://www.futureelectronics.com/en/technologies/semiconductors/optoelectronics/leds/Pages/9894312-LTST-C190GKT.aspx?CrossPart=HSMG-C190&IM=0> LilyPad 1206 - SMD1206 LilyPad package [Product Link] <http://www.futureelectronics.com/en/Technologies/Product.aspx?ProductID=IN150NGHARVATEKCORPORATION2049943&IM=0> 1206 - SMD1206 package [Product Link] <http://www.futureelectronics.com/en/technologies/semiconductors/optoelectronics/leds/Pages/8315665-LTST-C150KGKT.aspx?IM=0> 1206 Bottom Mount -SMD 1206 Bottom Mount [Product Link] <http://www.digikey.com/product-detail/en/lite-on-inc/LTST-C230KGKT/160-1456-1-ND/386854> SparkFun Products: Pro Mini 328 -5V <https://www.sparkfun.com/products/821> RedBoard <https://www.sparkfun.com/products/12757> MP3 Trigger <https://www.sparkfun.com/products/13720> Makey Makey <https://www.sparkfun.com/products/11076>; LCSC_PART: C434439; PROD_ID: DIO-00862
MS1 MS2 = Eagle_WA-SMSI (rev20d) (1):WA-SMSI_9774XXX151: WA-SMSI SMT Steel Spacer, M2.5 Thread Internal PROPERTIES Material Steel Surface Tin GENERAL INFORMATION Operating Temperature -55 up to +150 °C PACKAGING PROPERTIES Packaging Bag;​ Tape and Reel;​ Bulk Packaging Unit 450 <https://katalog.we-online.de/media/images/v2/o92910v209%20Family_WA-SMSI_M2-M2.5.jpg> Details see: https://katalog.we-online.de/en/em/SMSI_SMT_STEEL_SPACER_M2_5_THREAD_INTERNAL Updated by Ella Wu 2020-05-18 2020(C) Wurth Elektronik; DATASHEET-URL: https://www.we-online.de/katalog/datasheet/9774060151.pdf; INNER-DIAMETER: 3.5mm; INNER-THREAD-LENGTH: -; LCSC_PART: DNP; OUTER-DIAMETER: 5.1mm; PART-NUMBER: 9774060151; PIN-LENGTH: 6mm; THREAD: M2.5
QN1-QN4 QN10 QN11 = KVRLABS-Nfet:Pfet:NFET-(SOT-23-3)(TO-236-3)(SC-59); LCSC_PART: C296286
QN_SSR1-QN_SSR4 = PSFBC:IPB60R060P7ATMA1: IPB60R060P7ATMA1 VDS: 650V Id: 48A(Tc) Rdson: 60mOhm Vgsth: 4V https://www.digikey.com/product-detail/en/infineon-technologies/IPB60R060P7ATMA1/IPB60R060P7ATMA1CT-ND/8259678; CISS: 4050pF; COSS: 1480pF; CRSS: 58pF; LCSC_PART: DNP; MODEL: NP109N04PUK-E1-AY; QGC: 75nC; RDSON: 30mOhm; TDELAY: 60ns; TFALL: 20ns; TRISE: 30ns; VDS: 250V; VGSMAX: +/- 20V; VGSTH: 3.5V
QP1-QP6 = KVRLABS-Nfet:Pfet:PFET-(SOT-23-3)(TO-236-3)(SC-59); LCSC_PART: C489594; MODEL: MEM2307M3G
R1 RF2 RF3 = rcl:R-US_: RESISTOR, American symbol; LCSC_PART: C103197; SPICEPREFIX: R
R_ILIM1-R_ILIM4 = rcl:R-US_: RESISTOR, American symbol; LCSC_PART: C102322; SPICEPREFIX: R
RF1 = rcl:R-US_: RESISTOR, American symbol; LCSC_PART: C491175; SPICEPREFIX: R
RG1-RG4 = rcl:R-US_: RESISTOR, American symbol; LCSC_PART: C326706; SPICEPREFIX: R
RGD1 RLD1-RLD3 RPU2 = rcl:R-US_: RESISTOR, American symbol; LCSC_PART: C126358; SPICEPREFIX: R
RGS1 RGS5 RGS9 = rcl:R-US_: RESISTOR, American symbol; LCSC_PART: C118368; SPICEPREFIX: R
RGS2-RGS4 RGS6 RGS7 RGS10 RVRF2 = rcl:R-US_: RESISTOR, American symbol; LCSC_PART: C116677; SPICEPREFIX: R
RPD5 = rcl:R-US_: RESISTOR, American symbol; LCSC_PART: C95331; SPICEPREFIX: R
RPU3 RVRF1 = rcl:R-US_: RESISTOR, American symbol; LCSC_PART: C209133; SPICEPREFIX: R
RSHUNT1-RSHUNT4 = rcl:R-US_: RESISTOR, American symbol; LCSC_PART: C459689; MODEL: RLP25FEGR075; SPICEPREFIX: R
SJ1 = jumper:SJ2W: SMD solder JUMPER; LCSC_PART: DNP
SW_EFUSE_RST SW_EFUSE_RST1 = SparkFun-Switches:MOMENTARY-SWITCH-SPST: Momentary Switch (Pushbutton) - SPST Normally-open (NO) SPST momentary switches (buttons, pushbuttons). Variants PTH-12MM - 12mm square, through-hole Momentary Pushbutton Switch - 12mm Square <https://www.sparkfun.com/products/9190> (COM-09190) PTH-6.0MM, PTH-6.0MM-KIT - 6.0mm square, through-hole Mini Pushbutton Switch <https://www.sparkfun.com/products/97> (COM-00097) KIT package intended for soldering kit's - only one side of pads' copper is exposed. PTH-RIGHT-ANGLE-KIT - Right-angle, through-hole Right Angle Tactile Button <https://www.sparkfun.com/products/10791> - Used on SparkFun BigTime Watch Kit <https://www.sparkfun.com/products/11734> SMD-12MM - 12mm square, surface-mount Tactile Button - SMD (12mm) <https://www.sparkfun.com/products/12993> (COM-12993) Used on SparkFun PicoBoard <https://www.sparkfun.com/products/11888> SMD-4.5MM - 4.5mm Square Trackball Switch Used on SparkFun Blackberry Trackballer Breakout <https://www.sparkfun.com/products/13169> SMD-4.6MMX2.8MM - 4.60mm x 2.80mm, surface mount Used on SparkFun SAMD21 Mini Breakout <https://www.sparkfun.com/products/13664> SMD-5.2MM, SMD-5.2-REDUNDANT - 5.2mm square, surface-mount Mini Pushbutton Switch - SMD <https://www.sparkfun.com/products/8720> (COM-08720) Used on Arduino Pro Mini <https://www.sparkfun.com/products/11114> REDUNDANT package connects both switch circuits together SMD-6.0X3.5MM - 6.0 x 3.5mm, surface mount Momentary Reset Switch SMD <https://www.sparkfun.com/products/8229> (COM-08229) SMD-6.2MM-TALL - 6.2mm square, surface mount Tactile Button - SMD (6mm) <https://www.sparkfun.com/products/12992> Used on SparkFun Digital Sandbox <https://www.sparkfun.com/products/12651> SMD-RIGHT-ANGLE - Right-angle, surface mount Used on SparkFun Block for Intel® Edison - Arduino <https://www.sparkfun.com/products/13036>; LCSC_PART: C520860; MODEL: TS-1092S-B3D2-G; PROD_ID: SWCH-00815; SF_SKU: COM-08229
U2 = KVRLABS-Amplifiers:LMV331M5X; COPYRIGHT: Copyright (C) 2021 Ultra Librarian. All rights reserved.; LCSC_PART: C253067; MANUFACTURER_PART_NUMBER: LMV331M5X; MFR_NAME: Texas Instruments; MODEL: LMV331M5X/NOPB

## Net classes
0 default: width 0.089 mm, drill 0.2 mm, clearance 0.089 mm

## Board
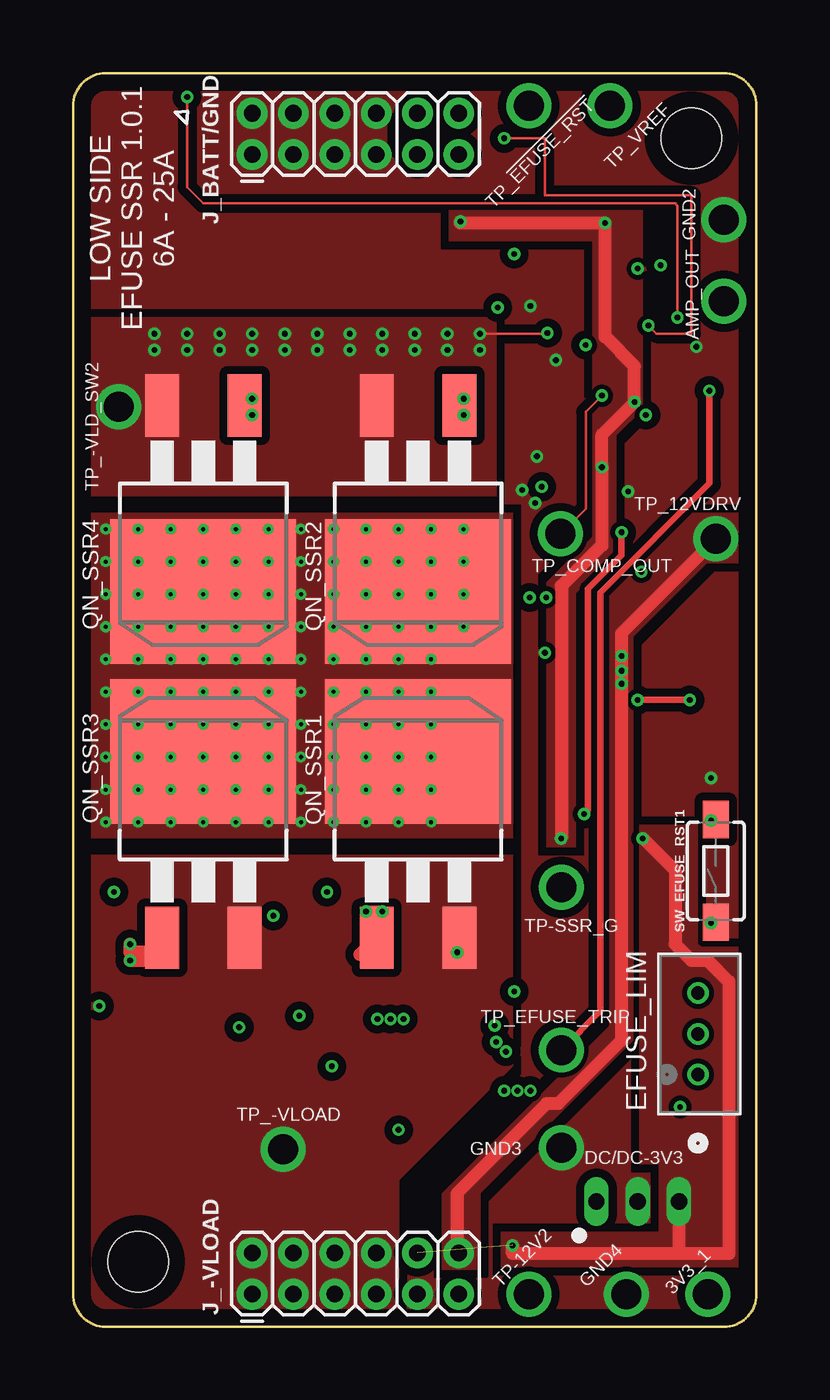
[diagram p8: board, top side]
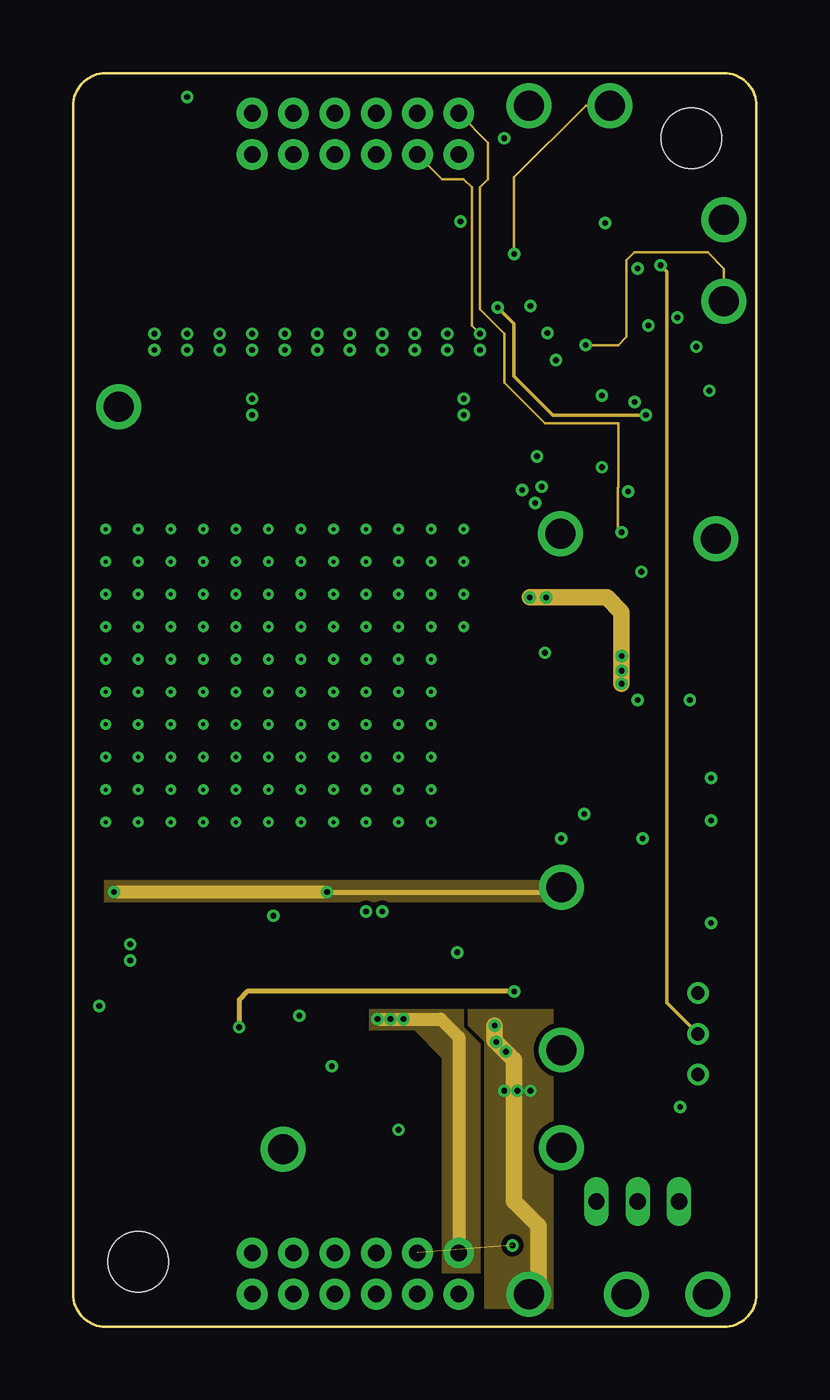
[diagram p9: board, inner layer Route2]
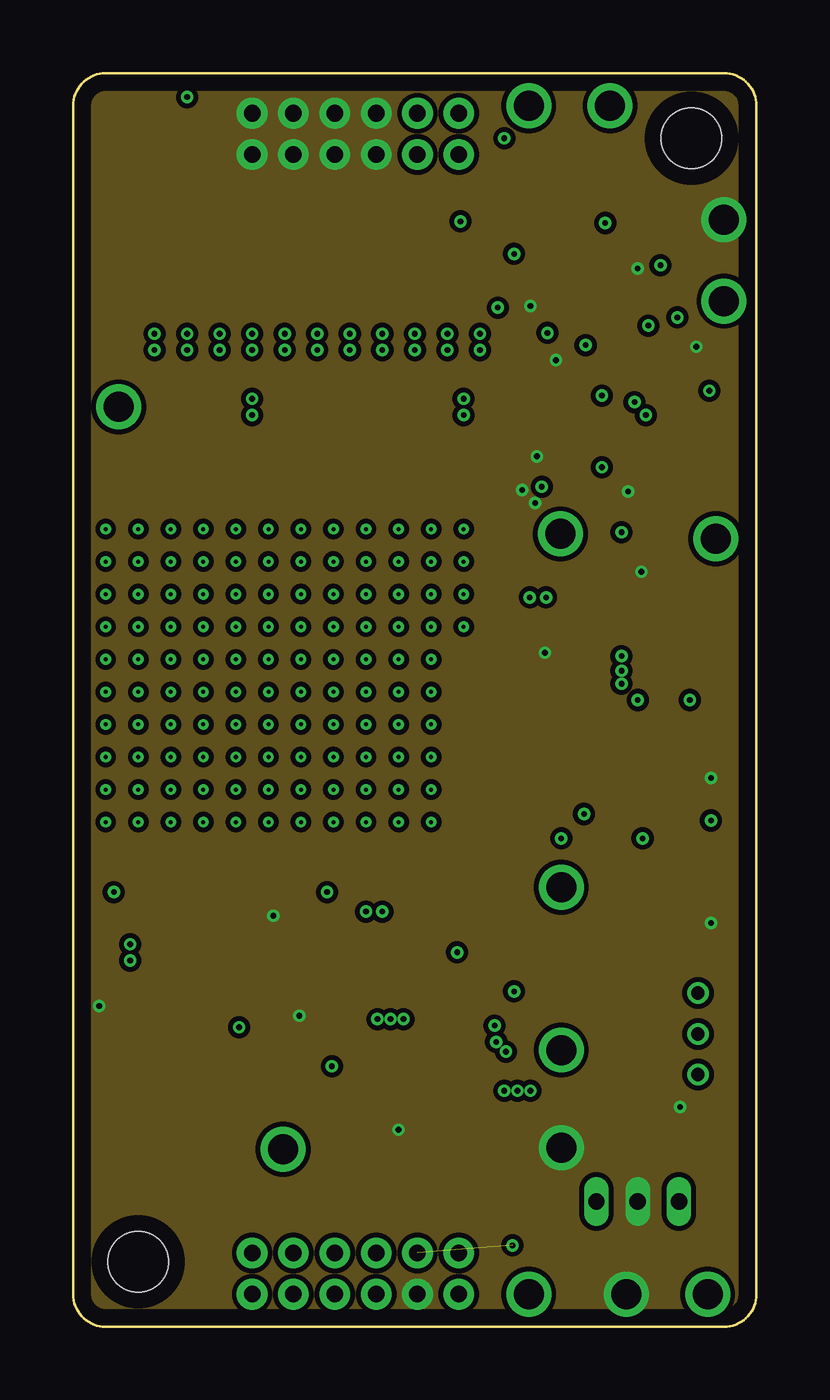
[diagram p10: board, inner layer Route15]
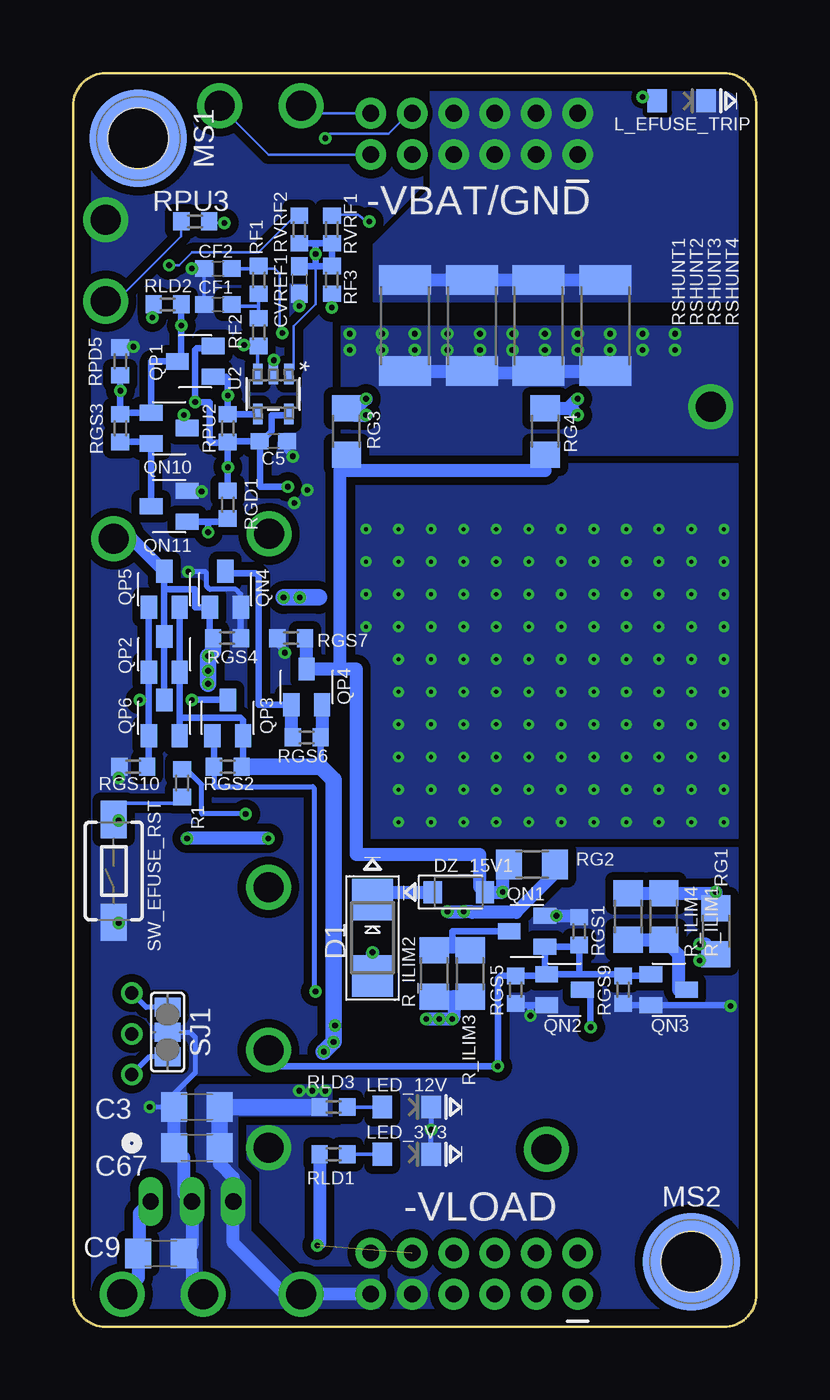
[diagram p11: board, bottom side, seen from below]

Size 42 x 77 mm. Coordinates in mm from the lower left corner, seen from the top.
Outline: 0,2 0,75 arc-90 2,77 40,77 arc-90 42,75 42,2 arc-90 40,0 2,0 arc-90 0,2
Copper layers (1*2*15*16): Top 0.035mm / dielectric 1.5mm / Route2 0.035mm / dielectric 0.15mm / Route15 0.035mm / dielectric 0.2mm / Bottom 0.035mm
Design rules "default *": minimum track width 6mil, minimum drill 0.35mm, track to track 6mil, track to pad 6mil, pad to pad 6mil, via to via 6mil, smd to smd 6mil, copper to edge 40mil, drill to drill 6mil, minimum pad ring 10mil, minimum via ring 8mil, stop-mask expansion 4mil, vias tented up to drill 0mil, thermal gap 5mil
tRestrict: area 19.8,72.3 to 20,74.1

### Footprints (pad centres in the part's own frame; a part is rotated, then mirrored left to right if it is on the bottom)
THM-TESTPOINT = drill 1.84: P1 0,0
C1206 = smd 1.6 x 1.8: 1 -1.4,0; 2 1.4,0
C0603 = smd 1.1 x 1: 1 -0.85,0; 2 0.85,0
SMADIODE = smd 2.54 x 2.54: A 2.349,0; C -2.349,0
3-SIP = drill 1 long: 1/VIN -2.54,0; 2/GND 0,0; 3/VOUT 2.54,0
SODFL3718X115 = smd 1.115 x 1.361: 1 -1.6,0; 2 1.6,0
POT_CT-94EW_NDC = drill 0.813 pad 1.321: 1 0,0; 2 2.489,0; 3 5.004,0
2X6 = drill 1.016 pad 1.88: 1 0,0; 2 0,2.54; 3 2.54,0; 4 2.54,2.54; 5 5.08,0; 6 5.08,2.54; 7 7.62,0; 8 7.62,2.54; 9 10.16,0; 10 10.16,2.54; 11 12.7,0; 12 12.7,2.54
LED-1206 = smd 1.2 x 1.4: A -1.5,0; C 1.5,0
WA-SMSI_9774060151 = smd 6 x 6: 1 0,0 | hole 3.7: 0,0
SOT23,SC-59,TO-236-3 = smd 1 x 1.4: P$1 0,1.1; P$2 -0.95,-1.1; P$3 0.95,-1.1
D2PACK = smd 2.083 x 3.81: 1 -2.54,-8.89; 3 2.54,-8.89 | smd 11.43 x 8.89: 2 0,2.54
R0603 = smd 1 x 1.1: 1 -0.85,0; 2 0.85,0
R1206 = smd 1.6 x 1.803: 1 -1.422,0; 2 1.422,0
R2512 = smd 1.8 x 3.2: 1 -2.8,0; 2 2.8,0
SJ_2 = smd 1.168 x 1.6: 1 -1.524,0; 2 0,0; 3 1.524,0
TACTILE_SWITCH_SMD_6.0X3.5MM = smd 2.3 x 1.6: 1 -3.15,0; 2 3.15,0
MF05A = smd 1.259 x 0.568: 1 -1.219,0.953; 2 -1.219,0; 3 -1.219,-0.953; 4 1.219,-0.953; 5 1.219,0.953

### Placement (x,y rotation side)
3V3_1  39,2 0 top
AMP_OUT  40,63 0 top
C3  34.4,13.5 0 bottom
C5  29.7,54.4 0 bottom
C9  36.6,4.5 180 bottom
C67  34.4,11 0 bottom
CF1  33.1,62.8 180 bottom
CF2  33.1,65 180 bottom
CVREF1  28.1,64.3 270 bottom
D1  23.6,23.9 270 bottom
DC/DC-3V3  34.7,7.7 0 top
DZ_15V1  18.3,26.7 0 bottom
EFUSE_LIM  38.4,15.5 90 top
GND2  40,68 90 top
GND3  30,11 180 top
GND4  34,2 180 top
J_-VLOAD  11,2 0 top
J_BATT/GND  11,72 0 top
L_EFUSE_TRIP  4.6,75.3 0 bottom
LED_3V3  21.5,10.6 0 bottom
LED_12V  21.5,13.5 0 bottom
MS1  38,73 0 bottom
MS2  4,4 0 bottom
QN1  14.1,24.3 90 bottom
QN2  11.8,20.7 270 bottom
QN3  5.4,20.7 270 bottom
QN4  32.65,45.3 0 bottom
QN10  36.1,55.2 270 bottom
QN11  36.1,50.4 90 bottom
QN_SSR1  21.2,32.8 0 top
QN_SSR2  21.2,47.7 180 top
QN_SSR3  8,32.8 0 top
QN_SSR4  8,47.7 180 top
QP1  34.5,59.3 90 bottom
QP2  36.4,41.3 0 bottom
QP3  32.5,37.4 0 bottom
QP4  27.65,39.3 0 bottom
QP5  36.4,45.3 0 bottom
QP6  36.4,37.4 0 bottom
R1  35.3,33.4 270 bottom
R_ILIM1  5.7,25.2 270 bottom
R_ILIM2  19.8,21.7 90 bottom
R_ILIM3  17.6,21.7 90 bottom
R_ILIM4  7.9,25.2 270 bottom
RF1  30.6,64.3 90 bottom
RF2  30.6,61.1 90 bottom
RF3  26.1,64.3 270 bottom
RG1  2.5,24.3 90 bottom
RG2  13.8,28.4 180 bottom
RG3  25.2,55 270 bottom
RG4  13,55 270 bottom
RGD1  32.5,50.5 270 bottom
RGS1  10.9,24.3 90 bottom
RGS2  32.5,34.4 180 bottom
RGS3  39.1,55.2 270 bottom
RGS4  32.55,42.3 0 bottom
RGS5  14.8,20.7 270 bottom
RGS6  27.65,36.2 180 bottom
RGS7  28.6,42.3 180 bottom
RGS9  8.2,20.7 270 bottom
RGS10  38.3,34.4 180 bottom
RLD1  26,10.6 0 bottom
RLD2  36.2,62.8 180 bottom
RLD3  26,13.5 0 bottom
RPD5  39.1,59.3 90 bottom
RPU2  32.5,55.2 90 bottom
RPU3  34.5,67.9 0 bottom
RSHUNT1  21.6,61.5 270 bottom
RSHUNT2  17.5,61.5 270 bottom
RSHUNT3  13.4,61.5 270 bottom
RSHUNT4  9.3,61.5 270 bottom
RVRF1  26.1,67.4 270 bottom
RVRF2  28.1,67.4 90 bottom
SJ1  36.2,18.1 90 bottom
SW_EFUSE_RST  39.5,28 90 bottom
SW_EFUSE_RST1  39.5,28 90 top
TP-12V2  28,2 180 top
TP-SSR_G  30,27 0 top
TP_12VDRV  39.5,48.4 0 top
TP_!EFUSE_RST  28,75 0 top
TP_-VLD_SW2  2.8,56.5 90 top
TP_-VLOAD  12.9,10.9 180 top
TP_COMP_OUT  29.95,48.7 0 top
TP_EFUSE_TRIP  30,17 0 top
TP_VREF  33,75 0 top
U2  29.7,57.3 270 bottom

### Tracks (layer width: path | path; a pad name or v marks a point on that pad's centre or on a via)
!EFUSE_RST  (via drill 0.35)
  Top 0.406: v33.7,48.8 33.7,47.39 31.64,45.33 31.64,31.74 v31.4,31.5
  Route2 0.152: v33.7,48.8 33.49,49.01 33.49,51.55 33.5,51.56 33.5,55.5 29,55.5 26.5,58 26.5,61 25,62.5 25,70 25.5,70.5 25.5,72.74 J_BATT/GND.12
  Bottom 0.152: J_BATT/GND.12 27.54,74.54 TP_!EFUSE_RST.P1
  Bottom 0.305: v31.4,31.5 34.1,31.5 34.1,33.3 35.05,34.25 R1.1
  Bottom 0.406: QN11.P$2 33.6,49.45 | 33.6,49.45 32.7,49.45 RGD1.2 | 33.6,49.45 33.7,49.35 v33.7,48.8
+3V3  (via drill 0.35)  (1 unrouted)
  Top 0.813: v30,30 30,45.5 32.5,48 v32.5,52.8 32.5,54.8 v34.5,56.8 34.5,59 32.7,60.8 v32.7,67.8 23.8,67.8 v23.8,67.9 | v35,30 37,28 37,23.5 38,22.5 39,22.5 40.3,21.2 40.3,4.5 37,4.5 | 37,4.5 27,4.5 v27,5 | DC/DC-3V3.3/VOUT 37.24,4.74 37,4.5
  Bottom 0.152: RPU3.2 33.55,67.8 v32.7,67.8 | RVRF1.1 26.05,68.3 24.5,68.3 23.97,67.9 v23.8,67.9
  Bottom 0.406: QP1.P$3 33.55,60.1 34.4,60.1 34.5,60 v34.5,56.8 33.6,56.8 33.6,54.3 32.55,54.3 RPU2.1 | C5.1 32.45,54.4 RPU2.1 | RPU2.1 v32.5,52.8 RGD1.1 | U2.5 28.83,56 29.8,56 29.8,55 30.4,54.4 C5.1 | C5.1 30.5,54.35 30.5,51.6 v28.8,51.6
  Bottom 0.813: DC/DC-3V3.3/VOUT 37.94,7 37.94,4.56 C9.2 38,3 3V3_1.P1 | RLD1.1 26.85,5.15 v27,5 | v30,30 v35,30
  pour Top (isolate 0.3, no thermals): 26.3,3.7 42.7,3.7 42.9,3.9 42.9,23.3 38.6,23.3 38.4,23.5 38.4,30.8 34.8,30.8 34.8,10 36,10 36,5.8 26.3,5.8
  pour Top (isolate 0.3, no thermals): 30.9,29.6 30.9,45.1 33.4,47.6 33.4,54.8 35,56.4 35,68.6 23.1,68.6 23.1,66.7 31.9,66.7 31.9,48.5 29.1,45.7 29.1,29.5 30.9,29.5
+12V  (via drill 0.35)
  Route2 1.016: TP-12V2.P1 28.6,2.6 28.6,6.2 27.1,7.7 27.1,16.4 v26,17.5 25.9,17.6 v25.9,18.5
  Bottom 0.406: QP5.P$3 QP2.P$3 35.45,37.4 | 35.45,37.4 QP6.P$3 | RGS2.1 31.55,34.5 QP3.P$3 31.55,37.25 31.7,37.4 35.45,37.4 | 26.8,34.4 RGS6.1
  Bottom 0.813: QP4.P$3 26.7,36.3 RGS6.1 | J_-VLOAD.11 TP-12V2.P1 29,2 32.16,5.16 DC/DC-3V3.1/VIN 32.16,9.16 33,10 C67.2
  Bottom 1.016: RGS2.1 26.8,34.4 26,33.6 v26,17.5 v26.6,16.9 | RLD3.1 C3.2 C67.2
  other vias: 26.5,14.5 27.3,14.5 28.1,14.5
  pour Route2 (isolate 0.3, no thermals): 25.3,-1.3 25.3,17.5 24.3,18.5 24.3,19.5 29.5,19.5 29.5,-1.5 25.5,-1.5
  pour Bottom (isolate 0.3, no thermals): 26.1,14.8 26.1,12.9 31.9,12.9 31.9,9.8 31.1,9 31.1,5.9 28.5,3.3 28.4,3.2 23.2,3.2 23.2,-1.1 23.3,-1.2 31.3,-1.2 31.5,-1 33.5,1 33.5,8.4 34.5,9.4 34.5,14.6 34.2,14.9 26.1,14.9
+12VDRV  (via drill 0.35)
  Top 0.813: TP_12VDRV.P1 33.7,42.6 v33.7,41.2 33.7,17.6 29.8,13.7 29.1,13.7 23.6,8.2 23.6,4.64 J_-VLOAD.12
  Route2 0.813: v18.7,18.9 22.6,18.9 23.7,17.8 J_-VLOAD.12
  Route2 1.016: v33.7,39.5 33.7,43.9 32.8,44.8 v29.06,44.8 v28.06,44.8
  Bottom 0.406: QP2.P$1 36.4,45.3 | 36.4,45.3 QP5.P$1 | QP2.P$1 QP6.P$1 | QP2.P$1 36.3,42.3 | RGS4.1 33.6,42.3 QN4.P$2 34.5,44.2 34.5,45.3 36.4,45.3
  Bottom 0.813: R_ILIM2.1 18.6,20.28 | 18.6,20.28 R_ILIM3.1 | 18.6,20.28 18.6,19 v18.7,18.9 v20.3,18.9 | QP5.P$1 38.4,48.4 TP_12VDRV.P1
  Bottom 1.016: RGS4.1 33.4,41.5 v33.7,41.2 v33.7,39.5 | 26.9,44.8 v29.06,44.8
  other vias: 19.5,18.9 33.7,40.3
  pour Top (isolate 0.3, no thermals): 22.7,3.5 22.7,8.2 33,18.5 33,44.9 38.1,50 44.6,50 44.6,46.9 38.9,46.9 34.4,42.4 34.4,17.6 25,8.2 25,3.6 24.9,3.5
  pour Route2 (isolate 0.3, no thermals): 18.2,19.5 24,19.5 24,18.4 25,17.4 25,3.3 22.7,3.3 22.7,16.5 21,18.2 18.2,18.2
-VLOAD  (via drill 0.35)
  Top 0.813: v23.6,23 23.6,23.77 QN_SSR1.3
  Bottom 0.813: D1.A v23.6,23
  pour Top (isolate 0.5, no thermals): -3,29 27,29 27,16 20,9 20,-2 -3,-2
-VLOAD_SW  (via drill 0.35)
  Top 0.152: v25,61 29.1,61 v29.15,61.05
  Route2 0.152: J_BATT/GND.9 22.66,70.5 24,70.5 24.5,70 24.5,61.5 v25,61
  Bottom 0.152: RF1.2 30.45,65 29.6,65 29.3,64.7 29.3,61.2 v29.15,61.05
  Bottom 0.2: CF2.1 30.75,65 RF1.2
  Bottom 0.813: RSHUNT1.2 RSHUNT2.2 17.4,58.6 13.5,58.6 RSHUNT3.2 RSHUNT4.2
  other vias: 5,60 5,61 7,61 7,60 9,60 9,61 11,60 11,61 13,61 13,60 15,60 15,61 17,61 17,60 19,60 19,61 21,61 21,60 23,60 23,61 25,60
  pour Top (isolate 0.5, no thermals): -2,51 -2,62 26,62 26,51
  pour Bottom (isolate 0.5, rank 4, no thermals): -3.5,53.5 25.5,53.5 25.5,61.5 -3.5,61.5
AMP_OUT  (via drill 0.35)
  Route2 0.152: v31.5,60.3 33.5,60.3 34,60.8 34,65.5 34.5,66 39,66 40,65 AMP_OUT.P1
  Bottom 0.152: AMP_OUT.P1 39.35,63 35.35,67 RPU3.1
  Bottom 0.2: RF2.1 30.65,60.2 U2.3
  Bottom 0.406: RF2.1 31.45,60.25 v31.5,60.3
COMPARATOR_OUT  (via drill 0.35)
  Top 0.152: v32.5,57.2 31.5,56.2 31.5,50.25 TP_COMP_OUT.P1
  Bottom 0.406: QP1.P$2 32.6,58.35 32.5,58.25 v32.5,57.2 RPU2.2 30.68,56.05 U2.4
EFUSE_TRIP  (via drill 0.35)
  Top 0.152: v35.35,61.5 35.85,61 38,61 38,69.5 29,69.5 29,73 v26.5,73
  Top 0.406: TP_EFUSE_TRIP.P1 32.4,19.4 32.4,45.1 39.1,51.8 v39.1,57.5
  Bottom 0.152: J_BATT/GND.10 21.35,74.54 22.62,73.27 26.23,73.27 v26.5,73
  Bottom 0.406: QN2.P$2 13,21.75 QN1.P$2 11,23.35 RGS1.1 10.9,21.75 10.8,21.65 | QN2.P$2 13,21.55 RGS5.1 15.75,21.55 15.9,21.4 v15.9,16 30.1,16 30,16.1 TP_EFUSE_TRIP.P1 | QN2.P$2 10.8,21.65 | 10.8,21.65 8.3,21.65 RGS9.1 6.6,21.55 QN3.P$2 | RPD5.1 v39.1,57.5 RGS3.1 39,56.15 QN10.P$2 37.2,59.3 QP1.P$1 35.35,59.55 v35.35,61.5 RLD2.1
GND  (via drill 0.35)
  Top 0.2: v39.2,24.8 39.25,24.85 SW_EFUSE_RST1.1
  Bottom 0.2: CF2.2 CF1.2 | v39.2,24.8 39.45,24.8 SW_EFUSE_RST1.1
  Bottom 0.305: LED_12V.C v20,12.1 LED_3V3.C | RGS7.2 29.45,41.85 v29,41.4 | QN4.P$3 31.7,45 32,45.3 33.6,45.3 33.8,45.5 33.8,46.3 33.88,46.38 v34.92,46.38 | SJ1.2 34.8,18.1 34.5,17.8 34.5,15.6 35.8,14.3 C3.1 v37.3,13.5
  Bottom 0.406: QN4.P$3 RGS4.2 | RGS9.2 8.1,19.75 QN3.P$3 1.65,19.75 v1.6,19.7 | RGS5.2 14.7,19.75 13.8,19.75 | 13.8,19.75 QN2.P$3 | RPD5.2 38.35,60.15 v38.3,60.2 | CVREF1.2 v28.1,62.7 | U2.2 29.7,59.35 v29.68,59.38 | C5.2 28.85,53.82 v28.5,53.47 | CF2.2 v34.7,65 | QN11.P$3 34.15,51.35 v34.1,51.3 | 13.8,19.75 13.9,19.65 v13.9,19.1
  Bottom 0.813: RSHUNT1.1 RSHUNT2.1 RSHUNT3.1 RSHUNT4.1 | RGS1.2 11,25.25 v12.3,25.25 QN1.P$3 | C3.1 C67.1 35.2,10.4 35.2,8.2 DC/DC-3V3.2/GND 34.7,5 C9.1 34.7,4 34.7,2.7 GND4.P1 | RGS10.2 39.2,34.35 v39.2,33.7
  other vias: 28.4,50.6 27.6,51.4
  pour Bottom (isolate 0.3, no thermals): 20,78 20,70 23.5,66.5 23.5,63 -1.5,63 -1.5,78.5 20,78.5
  pour Route15 (isolate 0.3, no thermals): -2,77 -2,-3 46,-3 46,79 -2,79
  pour Bottom (isolate 0.5, rank 6, no thermals): -3.9,62.1 24,62.1 24,66.6 20.5,70.1 20.5,79.4 45,79.4 45,-3.5 -3.9,-3.5
  pour Top (isolate 0.5, rank 6, no thermals): -5,80 -5,-5 50,-5 50,80
N$1
  Bottom 0.203: LED_3V3.A RLD1.2
N$2  (via drill 0.35)
  Top 0.152: v7,75.53 7,70 8,69 37,69 37.13,68.87 v37.13,62
  Bottom 0.152: L_EFUSE_TRIP.A 6.77,75.3 v7,75.53 | v37.13,62 37.05,62.08 RLD2.2
N$3
  Bottom 0.406: QN4.P$1 32.55,46.3 30.8,46.3 30.6,46.1 30.6,38.2 QP4.P$2
  Bottom 0.813: QP4.P$2 28.6,36.3 RGS6.2
N$4
  Bottom 0.203: LED_12V.A RLD3.2
N$5
  Bottom 0.813: D1.C 23.15,26.7 DZ_15V1.1
N$7  (via drill 0.35)
  Top 0.813: 23.91,56.42 QN_SSR2.1 23.74,56.26 v24,56
  Bottom 0.813: v24,57 24.58,56.42 RG3.1 24.78,56 v24,56
N$8  (via drill 0.35)
  Top 0.813: v3.5,22.5 4.05,22.5 | 4.05,22.5 QN_SSR3.1 4.55,23 3.5,23 v3.5,23.5 | 4.05,22.5 5,22.5
  Bottom 0.813: v3.5,22.5 2.88,22.5 RG1.1 3.12,23.5 v3.5,23.5
N$9  (via drill 0.35)
  Route2 0.2: v35.2,56 29.5,56 27.1,58.4 27.1,61.6 v26.1,62.6
  Bottom 0.406: v35.2,56 35.2,55.4 QN10.P$1 | v26.1,62.6 RF3.2
N$10  (via drill 0.35)
  Top 0.813: 10.71,56.42 QN_SSR4.1 11,56.13 v11,56
  Bottom 0.813: v11,56 11.42,56.42 RG4.1 11.58,56.42 v11,57
N$12  (via drill 0.35)
  Top 0.813: 17.63,22.88 QN_SSR1.1 19,24.25 v19,25.5 v18,25.5
  Bottom 0.813: RG2.1 12.38,27.86 14.78,25.46 17.49,25.46 17.53,25.5 v18,25.5 v19,25.5
N$13
  Bottom 0.406: QN11.P$1 QN10.P$3 | QN10.P$3 37.2,54.4 | 37.5,54.55 QN10.P$3 | RGS3.2 37.3,54.35 QN10.P$3
N$14  (via drill 0.35)
  Top 0.2: v39.2,31.1 39.45,31.1 SW_EFUSE_RST1.2
  Bottom 0.2: R1.2 35.7,32.15 39.25,32.15 39.75,31.65 39.25,31.15 | v39.2,31.1 39.25,31.15 | SW_EFUSE_RST1.2 39.25,31.15
N$15  (via drill 0.35)
  Route2 0.2: EFUSE_LIM.2 36.5,19.89 36.5,64.8 v36.1,65.2
  Bottom 0.152: RVRF2.2 28.35,68.25 30.6,66 34.7,66 35.5,65.2 v36.1,65.2
  Bottom 0.2: RVRF2.2 28.4,67.95
N$16  (via drill 0.35)
  Top 0.406: v34.7,38.5 v37.9,38.5
  Bottom 0.406: QP5.P$2 QP2.P$2 37.35,38.5 | 37.35,38.5 QP6.P$2 37.35,34.5 RGS10.1 | QP3.P$1 v34.7,38.5 | v37.9,38.5 37.35,38.5
N$17
  Bottom 0.406: R_ILIM4.2 R_ILIM1.2 5.5,23.78 5,23.78 | QN3.P$1 4.8,20.7
  Bottom 0.813: R_ILIM4.2 5.5,23.78 | R_ILIM1.2 4.8,22.88 4.8,20.7
N$18  (via drill 0.35)
  Route2 0.305: v27.1,20.6 10.7,20.6 10.2,20.1 v10.2,18.4
  Bottom 0.305: RGS2.2 33.35,33.18 27.28,33.18 27.2,33.1 27.2,20.7 v27.1,20.6
  Bottom 0.406: QP3.P$2 33.35,36.2 RGS2.2 | QN2.P$1 10.2,20.2 v10.2,18.4
N$19
  Bottom 0.305: SJ1.1 37.32,16.58 EFUSE_LIM.1
N$20
  Bottom 0.305: SJ1.3 37.52,19.62 EFUSE_LIM.3
OUTA_H
  Bottom 0.406: R_ILIM2.2 18.7,23.12 | 18.7,23.12 R_ILIM3.2 | QN1.P$1 18.7,24.3 18.7,23.12
SSR_G  (via drill 0.35)
  Route2 0.305: 14.1,26.7 29.7,26.7 TP-SSR_G.P1
  Route2 0.813: v15.6,26.7 14.1,26.7 v2.5,26.7
  Bottom 0.813: RGS7.1 27.65,42.2 QP4.P$1 25.6,40.4 | 25.6,40.4 24.6,40.4 24.6,29 17,29 17,27 DZ_15V1.2 v15.6,26.7 15.6,28.02 RG2.2 | 25.6,40.4 25.6,52.6 | R_ILIM1.1 R_ILIM4.1 2.58,26.62 | 2.58,26.62 v2.5,26.7 | RG1.2 2.5,26.54 2.58,26.62 | RG3.2 25.6,53.18 25.6,52.6 | 25.6,52.6 13,52.6 RG4.2
  pour Route2 (isolate 0.3, no thermals): 1.9,27.2 1.9,26.1 30.3,26.1 30.3,27.4 1.9,27.4
VOUTB
  Bottom 0.2: RF1.1 30.6,62.7 | 30.6,62.7 RF2.2 | CF1.1 32.15,62.7 30.6,62.7
VREF  (via drill 0.35)
  Route2 0.152: v27.1,65.9 27.1,70.6 31.5,75 TP_VREF.P1
  Bottom 0.152: J_BATT/GND.11 30,72 TP_VREF.P1 | RF3.1 26.05,65.1 | 28.5,59.1 28.75,58.85 U2.1 28.45,58.82 28.45,61.45 27.1,62.8 27.1,65.15
  Bottom 0.2: 25.65,64.7 RF3.1
  Bottom 0.406: 26.1,65.4 RVRF1.2 27.1,66.55 | 26.1,65.4 RF3.1 | CVREF1.1 27.1,65.15 | 27.1,65.15 26.35,65.15 26.1,65.4 | RVRF2.1 27.1,66.55 | 27.1,65.15 v27.1,65.9 27.1,66.55
VSS_A1  (via drill 0.25)
  other vias: 4,49 6,49 6,47 4,47 4,45 6,45 8,45 8,47 8,49 10,49 10,47 10,45 12,45 12,47 12,49 14,49 14,47 14,45 16,45 16,47 16,49 18,49 20,49 20,47 18,47 18,45 20,45 20,43 18,43 16,43 14,43 12,43 10,43 8,43 6,43 4,43 4,41 6,41 8,41 10,41 12,41 14,41 16,41 18,41 20,41 20,39 18,39 16,39 14,39 12,39 10,39 8,39 6,39 4,39 2,39 2,41 2,43 2,45 2,47 2,49 20,37 18,37 16,37 14,37 12,37 10,37 8,37 6,37 4,37 2,37 2,35 2,33 2,31 4,31 6,31 8,31 10,31 12,31 14,31 16,31 18,31 20,31 20,33 20,35 18,35 18,33 16,33 16,35 14,35 14,33 12,33 12,35 10,35 10,33 8,33 8,35 6,35 6,33 4,33 4,35 22,49 24,49 24,47 22,47 22,45 24,45 24,43 22,43 22,41 22,39 22,37 22,35 22,33 22,31
  pour Top (no thermals): -2,50 27,50 27,30 -2,30
  pour Bottom (isolate 0.5, rank 4, no thermals): -2,53 25,53 25,30 -2,30

### Text on the board
tNames: LOW SIDE / EFUSE SSR 1.0.1 / 6A - 25A
bNames: -VBAT/GND | -VLOAD